# EAGLE design OSO-BOOK-B1-00 (EAGLE 9.6.2)

## Sheet 1 of 2
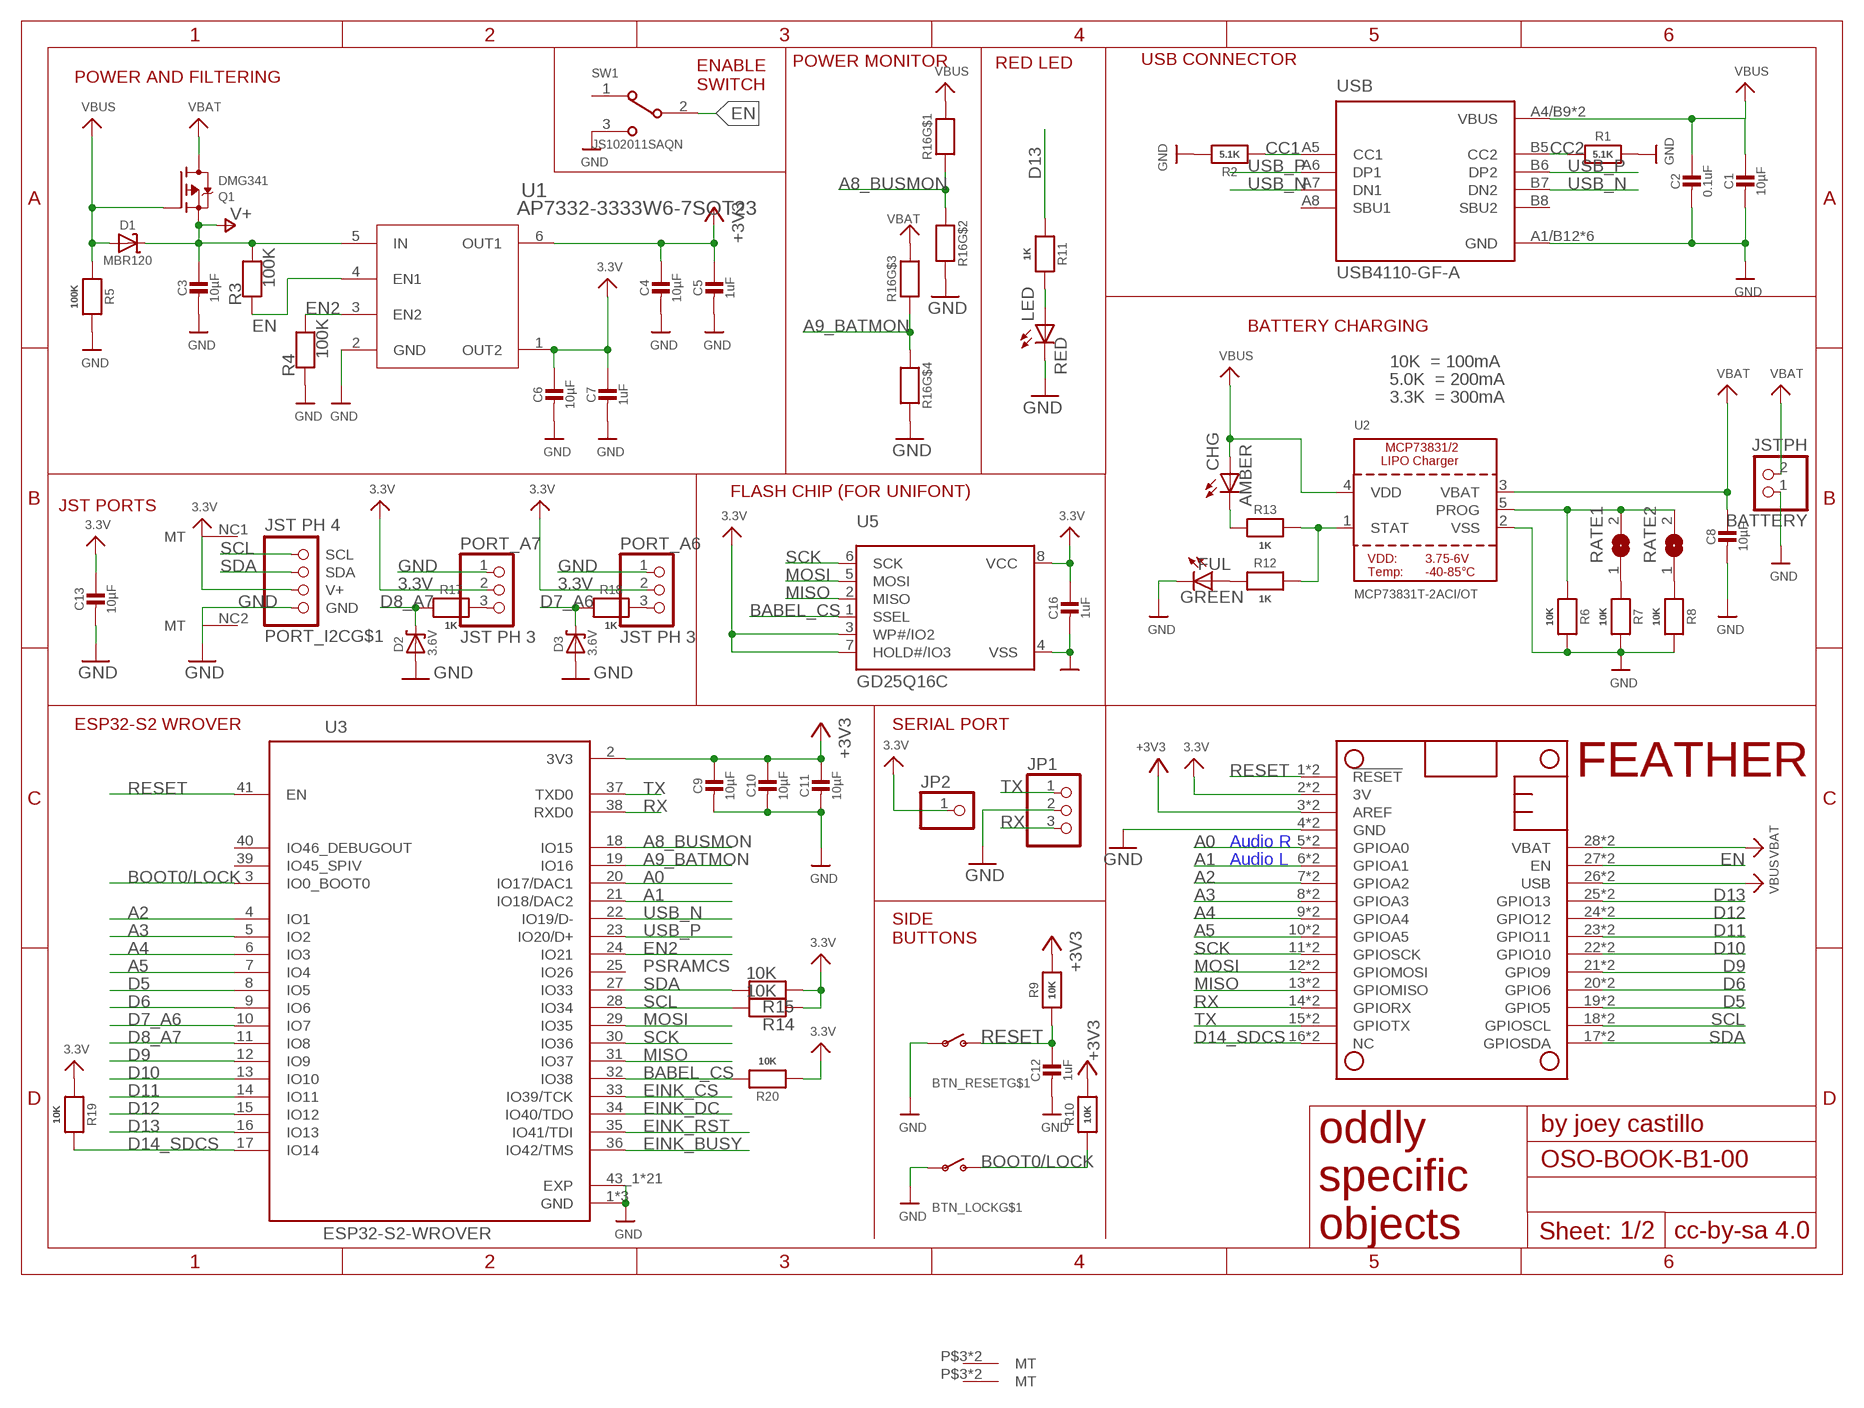
[diagram p0: schematic, sheet 1]

### Parts
BATTERY  JSTPH  CON_JST_PH_2PIN  [JSTPH2]
BTN_LOCK  SWITCH_SPSTTL3330A  [TL3330A]
BTN_RESET  SWITCH_SPSTTL3330A  [TL3330A]
C1  10µF  CAP_CERAMIC0805-NOOUTLINE  [0805-NO]
C2  0.1uF  CAP_CERAMIC0805-NOOUTLINE  [0805-NO]
C3  10µF  CAP_CERAMIC0805-NOOUTLINE  [0805-NO]
C4  10µF  CAP_CERAMIC0805-NOOUTLINE  [0805-NO]
C5  1uF  CAP_CERAMIC0805-NOOUTLINE  [0805-NO]
C6  10µF  CAP_CERAMIC0805-NOOUTLINE  [0805-NO]
C7  1uF  CAP_CERAMIC0805-NOOUTLINE  [0805-NO]
C8  10µF  CAP_CERAMIC0805-NOOUTLINE  [0805-NO]
C9  10µF  CAP_CERAMIC0805-NOOUTLINE  [0805-NO]
C10  10µF  CAP_CERAMIC0805-NOOUTLINE  [0805-NO]
C11  10µF  CAP_CERAMIC0805-NOOUTLINE  [0805-NO]
C12  1uF  CAP_CERAMIC0805-NOOUTLINE  [0805-NO]
C13  10µF  CAP_CERAMIC0805-NOOUTLINE  [0805-NO]
C16  1uF  CAP_CERAMIC0805-NOOUTLINE  [0805-NO]
CHG  AMBER  LEDCHIP-LED0805  [CHIP-LED0805]
D1  MBR120  DIODE-SCHOTTKYSOD-123  [SOD-123]
D2  3.6V  DIODE-ZENERSOD123  [SOD-123]
D3  3.6V  DIODE-ZENERSOD123  [SOD-123]
FUL  GREEN  LEDCHIP-LED0805  [CHIP-LED0805]
JP1  PINHD-1X3  [1X03]
JP2  PINHD-1X1  [1X01]
LED  RED  LEDCHIP-LED0805  [CHIP-LED0805]
MS1  FEATHERWING_SMTDUALNOHOLES  [FEATHERWING_SMT_NOHOLES]
PORT_A6  JST PH 3  CON_JST_PH_3PIN  [JSTPH3]
PORT_A7  JST PH 3  CON_JST_PH_3PIN  [JSTPH3]
PORT_I2C  JST PH 4  STEMMA_I2C_RASMT  [JSTPH4]
Q1  DMG341  MOSFET-P  [SOT23-R]
R1  5.1K  RESISTOR0805_NOOUTLINE  [0805-NO]
R2  5.1K  RESISTOR0805_NOOUTLINE  [0805-NO]
R3  100K  RESISTOR0805_NOOUTLINE  [0805-NO]
R4  100K  RESISTOR0805_NOOUTLINE  [0805-NO]
R5  100K  RESISTOR0805_NOOUTLINE  [0805-NO]
R6  10K  RESISTOR0805_NOOUTLINE  [0805-NO]
R7  10K  RESISTOR0805_NOOUTLINE  [0805-NO]
R8  10K  RESISTOR0805_NOOUTLINE  [0805-NO]
R9  10K  RESISTOR0805_NOOUTLINE  [0805-NO]
R10  10K  RESISTOR0805_NOOUTLINE  [0805-NO]
R11  1K  RESISTOR0805_NOOUTLINE  [0805-NO]
R12  1K  RESISTOR0805_NOOUTLINE  [0805-NO]
R13  1K  RESISTOR0805_NOOUTLINE  [0805-NO]
R14  10K  RESISTOR0805_NOOUTLINE  [0805-NO]
R15  10K  RESISTOR0805_NOOUTLINE  [0805-NO]
R16  EXB-V8V103JV-GOOD  [EXBV8V]
R17  1K  RESISTOR0805_NOOUTLINE  [0805-NO]
R18  1K  RESISTOR0805_NOOUTLINE  [0805-NO]
R19  10K  RESISTOR0805_NOOUTLINE  [0805-NO]
R20  10K  RESISTOR0805_NOOUTLINE  [0805-NO]
RATE1  SOLDERJUMPER  [SOLDERJUMPER_ARROW_NOPASTE]
RATE2  SOLDERJUMPER  [SOLDERJUMPER_ARROW_NOPASTE]
SW1  JS102011SAQN  [SW_JS102011SAQN]
U1  AP7332-3333W6-7SOT23  [SOT23-6]
U2  MCP73831T-2ACI/OT  MCP73831/2  [SOT23-5]
U3  ESP32-S2-WROVER  [MODULE_ESP32-S2-WROVER]
U5  GD25Q16C  MICROBUILDER_SPIFLASH_SOIC8  [MICROBUILDER_SOIC8_150MIL]
USB  USB4110-GF-A  [GCT_USB4110-GF-A]

### Nets
3.3V [power]: C6.1 C7.1 C13.1 C16.1 JP2.1 MS1.2(3V) MS1.2B(3V) PORT_A6.2 PORT_A7.2 PORT_I2C.2(V+) R14.1 R15.1 R19.1 R20.1 U1.1(OUT2) U5.3(WP#/IO2) U5.7(HOLD#/IO3) U5.8(VCC) ; also sheet 2
+3V3 [power]: C4.1 C5.1 C9.1 C10.1 C11.1 MS1.3(AREF) MS1.3B(AREF) R9.2 R10.2 U1.6(OUT1) U3.2(3V3)
A0: MS1.5(GPIOA0) MS1.5B(GPIOA0) U3.20(IO17/DAC1)
A1: MS1.6(GPIOA1) MS1.6B(GPIOA1) U3.21(IO18/DAC2)
A2: MS1.7(GPIOA2) MS1.7B(GPIOA2) U3.4(IO1)
A3: MS1.8(GPIOA3) MS1.8B(GPIOA3) U3.5(IO2)
A4: MS1.9(GPIOA4) MS1.9B(GPIOA4) U3.6(IO3)
A5: MS1.10(GPIOA5) MS1.10B(GPIOA5) U3.7(IO4)
A6: PORT_A6.3 R18.1
A7: PORT_A7.3 R17.1
A8_BUSMON: R16.1 R16.2 U3.18(IO15)
A9_BATMON: R16.3 R16.4 U3.19(IO16)
BABEL_CS: R20.2 U3.32(IO38) U5.1(SSEL)
BOOT0/LOCK: BTN_LOCK.P$2(S) R10.1 U3.3(IO0_BOOT0)
CC1: R2.1 USB.A5(CC1)
CC2: R1.1 USB.B5(CC2)
D5: MS1.19(GPIO5) MS1.19B(GPIO5) U3.8(IO5)
D6: MS1.20(GPIO6) MS1.20B(GPIO6) U3.9(IO6)
D7_A6: D3.C R18.2 U3.10(IO7)
D8_A7: D2.C R17.2 U3.11(IO8)
D9: MS1.21(GPIO9) MS1.21B(GPIO9) U3.12(IO9)
D10: MS1.22(GPIO10) MS1.22B(GPIO10) U3.13(IO10)
D11: MS1.23(GPIO11) MS1.23B(GPIO11) U3.14(IO11)
D12: MS1.24(GPIO12) MS1.24B(GPIO12) U3.15(IO12)
D13: MS1.25(GPIO13) MS1.25B(GPIO13) R11.1 U3.16(IO13)
D14_SDCS: MS1.16(NC) MS1.16B(NC) R19.2 U3.17(IO14) ; also sheet 2
EINK_BUSY: U3.36(IO42/TMS) ; also sheet 2
EINK_CS: U3.33(IO39/TCK) ; also sheet 2
EINK_DC: U3.34(IO40/TDO) ; also sheet 2
EINK_RST: U3.35(IO41/TDI) ; also sheet 2
EN: MS1.27(EN) MS1.27B(EN) R3.1 SW1.2 U1.4(EN1)
EN2: R4.2 U1.3(EN2) U3.24(IO21)
GND [gnd]: BATTERY.1 BTN_LOCK.P$1(P) BTN_RESET.P$1(P) C1.2 C2.2 C3.2 C4.2 C5.2 C6.2 C7.2 C8.2 C9.2 C10.2 C11.2 C12.2 C13.2 C16.2 D2.A D3.A FUL.C JP1.2 LED.C MS1.4(GND) MS1.4B(GND) PORT_A6.1 PORT_A7.1 PORT_I2C.1(GND) R1.2 R2.2 R4.1 R5.2 R6.2 R7.2 R8.2 R16.5 R16.7 SW1.3 U1.2(GND) U2.2(VSS) U3.1(GND) U3.26(GND) U3.42(GND) U3.43_1(EXP) U3.43_2(EXP) U3.43_3(EXP) U3.43_4(EXP) U3.43_5(EXP) U3.43_6(EXP) U3.43_7(EXP) U3.43_8(EXP) U3.43_9(EXP) U3.43_10(EXP) U3.43_11(EXP) U3.43_12(EXP) U3.43_13(EXP) U3.43_14(EXP) U3.43_15(EXP) U3.43_16(EXP) U3.43_17(EXP) U3.43_18(EXP) U3.43_19(EXP) U3.43_20(EXP) U3.43_21(EXP) U5.4(VSS) USB.A1/B12(GND) USB.B1/A12(GND) USB.S1(GND) USB.S2(GND) USB.S3(GND) USB.S4(GND) ; also sheet 2
MISO: MS1.13(GPIOMISO) MS1.13B(GPIOMISO) U3.31(IO37) U5.2(MISO) ; also sheet 2
MOSI: MS1.12(GPIOMOSI) MS1.12B(GPIOMOSI) U3.29(IO35) U5.5(MOSI) ; also sheet 2
N$1: R7.1 RATE1.1
N$4: CHG.C R13.1
N$5: R8.1 RATE2.1
N$7: LED.A R11.2
N$9: FUL.A R12.1
PROG: R6.1 RATE1.2 RATE2.2 U2.5(PROG)
RESET: BTN_RESET.P$2(S) C12.1 MS1.1(!RESET) MS1.1B(!RESET) R9.1 U3.41(EN)
RX: JP1.3 MS1.14(GPIORX) MS1.14B(GPIORX) U3.38(RXD0)
SCK: MS1.11(GPIOSCK) MS1.11B(GPIOSCK) U3.30(IO36) U5.6(SCK) ; also sheet 2
SCL: MS1.18(GPIOSCL) MS1.18B(GPIOSCL) PORT_I2C.4(SCL) R14.2 U3.28(IO34) ; also sheet 2
SDA: MS1.17(GPIOSDA) MS1.17B(GPIOSDA) PORT_I2C.3(SDA) R15.2 U3.27(IO33) ; also sheet 2
STAT: R12.2 R13.2 U2.1(STAT)
TX: JP1.1 MS1.15(GPIOTX) MS1.15B(GPIOTX) U3.37(TXD0)
USB_N: U3.22(IO19/D-) USB.A7(DN1) USB.B7(DN2)
USB_P: U3.23(IO20/D+) USB.A6(DP1) USB.B6(DP2)
V+ [power]: C3.1 D1.C Q1.2(S) R3.2 U1.5(IN)
VBAT [power]: BATTERY.2 C8.1 MS1.28(VBAT) MS1.28B(VBAT) Q1.3(D) R16.6 U2.3(VBAT)
VBUS [power]: C1.1 C2.1 CHG.A D1.A MS1.26(USB) MS1.26B(USB) Q1.1(G) R5.1 R16.8 U2.4(VDD) USB.A4/B9(VBUS) USB.B4/A9(VBUS)
Unconnected: BTN_LOCK.P$3(MT) BTN_LOCK.P$4(MT) BTN_RESET.P$3(MT) BTN_RESET.P$4(MT) PORT_I2C.NC1(MT) PORT_I2C.NC2(MT) SW1.1 U3.25(IO26) U3.39(IO45_SPIV) U3.40(IO46_DEBUGOUT) USB.A8(SBU1) USB.B8(SBU2)

### Notes on the sheet
- POWER MONITOR | RED LED | USB CONNECTOR
- POWER AND FILTERING
- ENABLE
  SWITCH
- BATTERY CHARGING
- 10K  = 100mA
- 5.0K  = 200mA
- 3.3K  = 300mA
- FLASH CHIP (FOR UNIFONT)
- JST PORTS
- ESP32-S2 WROVER | SERIAL PORT
- FEATHER
- Audio R
- Audio L
- SIDE
  BUTTONS
- PSRAMCS

## Sheet 2 of 2
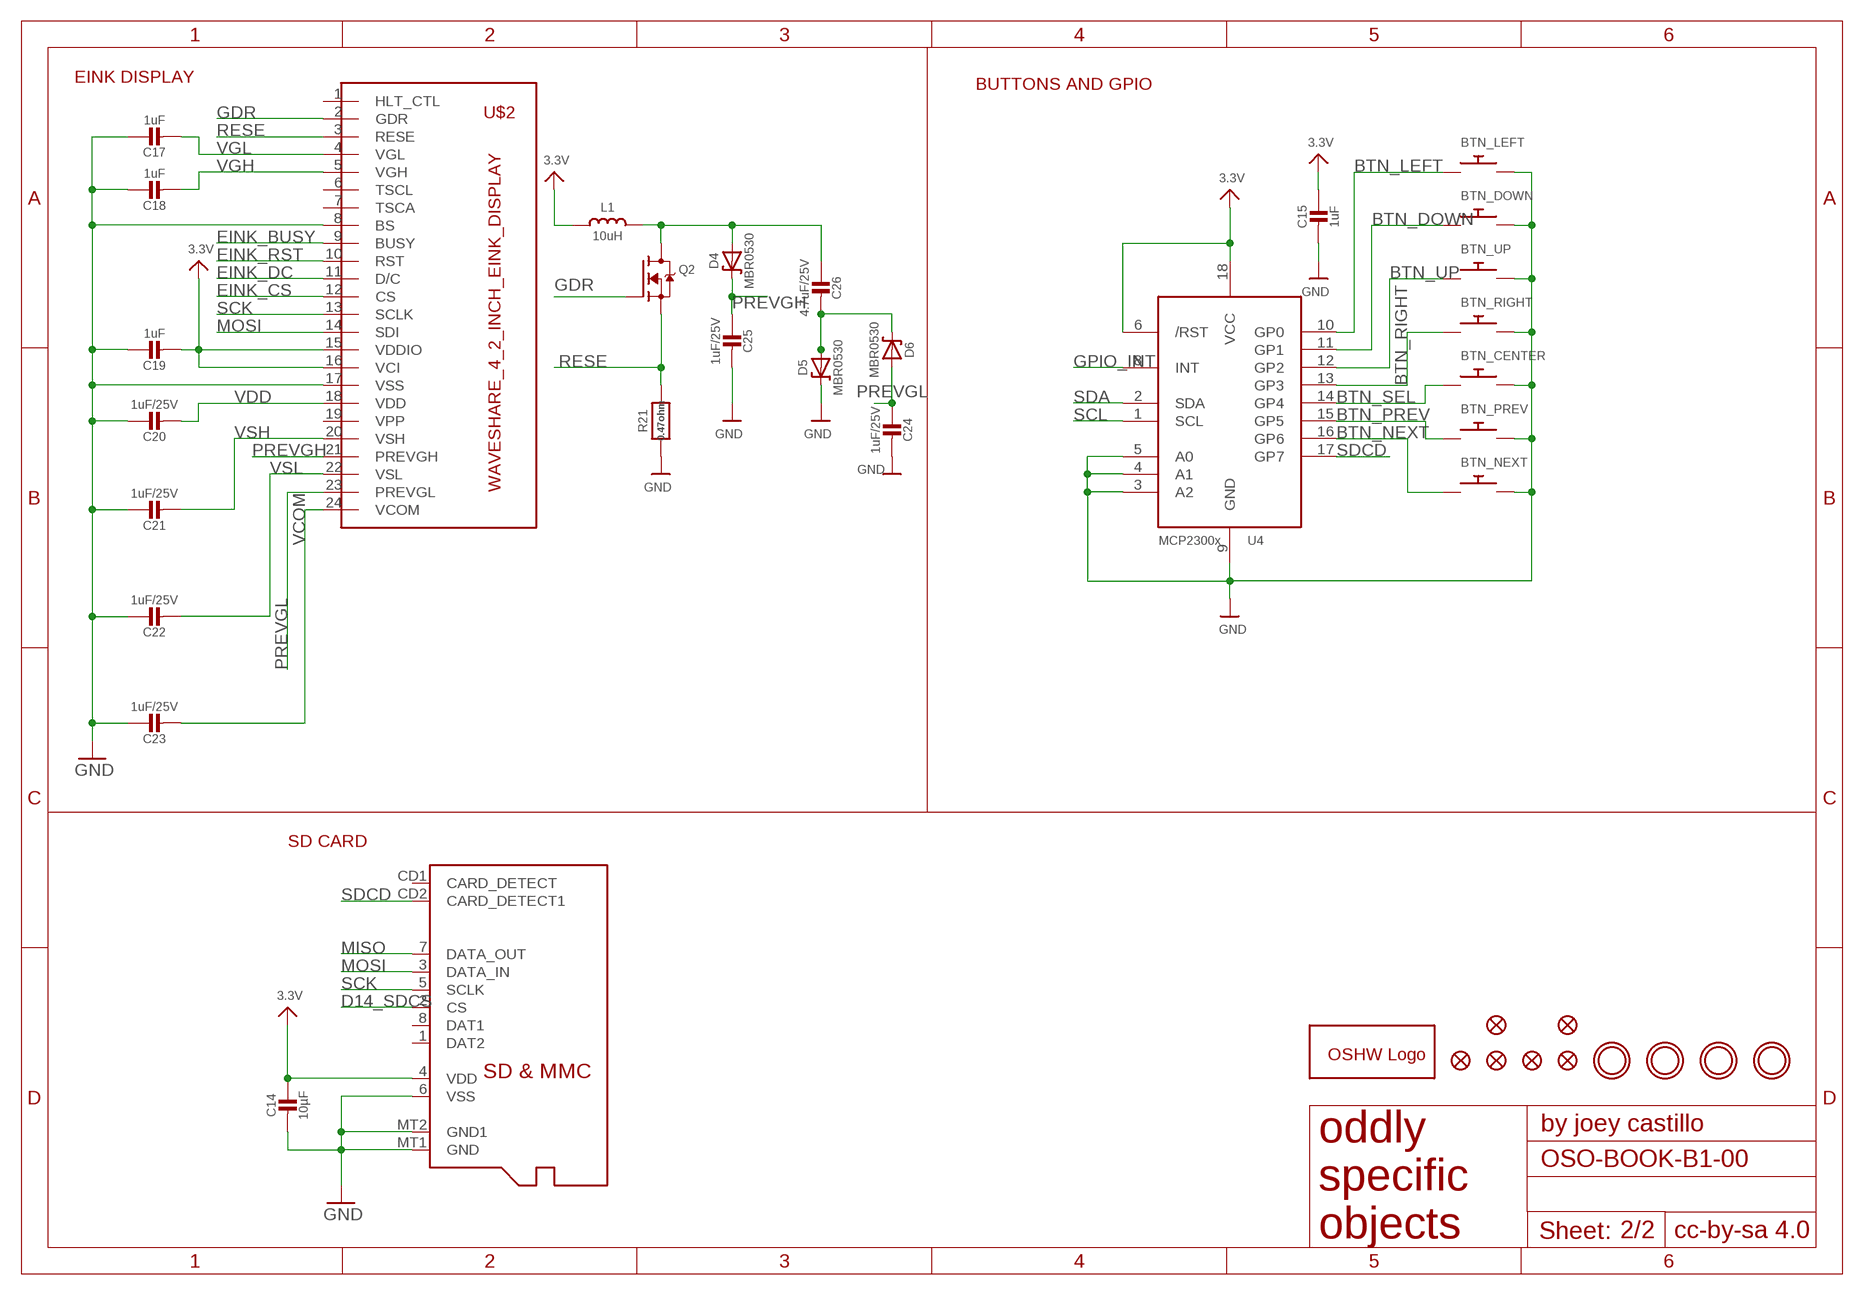
[diagram p1: schematic, sheet 2]

### Parts
BTN_CENTER  SWITCH_PUSHBUTTON_3.5X6MM  [TACTILE_3X6MM]
BTN_DOWN  SWITCH_PUSHBUTTON_3.5X6MM  [TACTILE_3X6MM]
BTN_LEFT  SWITCH_PUSHBUTTON_3.5X6MM  [TACTILE_3X6MM]
BTN_NEXT  SWITCH_PUSHBUTTON_3.5X6MM  [TACTILE_3X6MM]
BTN_PREV  SWITCH_PUSHBUTTON_3.5X6MM  [TACTILE_3X6MM]
BTN_RIGHT  SWITCH_PUSHBUTTON_3.5X6MM  [TACTILE_3X6MM]
BTN_UP  SWITCH_PUSHBUTTON_3.5X6MM  [TACTILE_3X6MM]
C14  10µF  CAP_CERAMIC0805-NOOUTLINE  [0805-NO]
C15  1uF  CAP_CERAMIC0805-NOOUTLINE  [0805-NO]
C17  1uF  CAP_CERAMIC0805-NOOUTLINE  [0805-NO]
C18  1uF  CAP_CERAMIC0805-NOOUTLINE  [0805-NO]
C19  1uF  CAP_CERAMIC0805-NOOUTLINE  [0805-NO]
C20  1uF/25V  CAP_CERAMIC0805-NOOUTLINE  [0805-NO]
C21  1uF/25V  CAP_CERAMIC0805-NOOUTLINE  [0805-NO]
C22  1uF/25V  CAP_CERAMIC0805-NOOUTLINE  [0805-NO]
C23  1uF/25V  CAP_CERAMIC0805-NOOUTLINE  [0805-NO]
C24  1uF/25V  CAP_CERAMIC0805-NOOUTLINE  [0805-NO]
C25  1uF/25V  CAP_CERAMIC0805-NOOUTLINE  [0805-NO]
C26  4.7uF/25V  CAP_CERAMIC0805-NOOUTLINE  [0805-NO]
D4  MBR0530  DIODE-SCHOTTKYSOD-123  [SOD-123]
D5  MBR0530  DIODE-SCHOTTKYSOD-123  [SOD-123]
D6  MBR0530  DIODE-SCHOTTKYSOD-123  [SOD-123]
FID1  FIDUCIAL_1MM  [FIDUCIAL_1MM]
FID2  FIDUCIAL_1MM  [FIDUCIAL_1MM]
FID3  FIDUCIAL_1MM  [FIDUCIAL_1MM]
FID4  FIDUCIAL_1MM  [FIDUCIAL_1MM]
FID5  FIDUCIAL_1MM  [FIDUCIAL_1MM]
FID6  FIDUCIAL_1MM  [FIDUCIAL_1MM]
GOLD_ORB_SM1  OSHWLOGOLOGO5MM  [OSHW_5MM]
L1  10uH  MICROBUILDER_INDUCTORNR401_BIGPADS  [MICROBUILDER_INDUCTOR_4X4MM_NR401_BIGPADS]
MICROSD  MICROSD  [MICROSD]
Q2  IRLML0100  IRLML2060TRPBF  [SOT23-3]
R21  0.47ohm  RESISTOR0805_NOOUTLINE  [0805-NO]
U4  MCP23008/SO  [SO18W]
U$1  MOUNTINGHOLE2.5  [MOUNTINGHOLE_2.5_PLATED]
U$2  WAVESHARE_4_2_INCH_EINK_DISPLAY  [EINK_DISPLAY_4_2IN]
U$4  MOUNTINGHOLE2.5  [MOUNTINGHOLE_2.5_PLATED]
U$5  MOUNTINGHOLE2.5  [MOUNTINGHOLE_2.5_PLATED]
U$7  MOUNTINGHOLE2.5  [MOUNTINGHOLE_2.5_PLATED]

### Nets
3.3V [power]: C14.1 C15.1 C19.2 L1.P$1 MICROSD.4(VDD) U4.6(/RST) U4.18(VCC) U$2.15(VDDIO) U$2.16(VCI) ; also sheet 1
BTN_DOWN: BTN_DOWN.P$1 U4.11(GP1)
BTN_LEFT: BTN_LEFT.P$1 U4.10(GP0)
BTN_NEXT: BTN_NEXT.P$1 U4.16(GP6)
BTN_PREV: BTN_PREV.P$1 U4.15(GP5)
BTN_RIGHT: BTN_RIGHT.P$1 U4.13(GP3)
BTN_SEL: BTN_CENTER.P$1 U4.14(GP4)
BTN_UP: BTN_UP.P$1 U4.12(GP2)
D14_SDCS: MICROSD.2(CS) ; also sheet 1
EINK_BUSY: U$2.9(BUSY) ; also sheet 1
EINK_CS: U$2.12(CS) ; also sheet 1
EINK_DC: U$2.11(D/C) ; also sheet 1
EINK_RST: U$2.10(RST) ; also sheet 1
GDR: Q2.1(G) U$2.2(GDR)
GND [gnd]: BTN_CENTER.P$2 BTN_DOWN.P$2 BTN_LEFT.P$2 BTN_NEXT.P$2 BTN_PREV.P$2 BTN_RIGHT.P$2 BTN_UP.P$2 C14.2 C15.2 C17.1 C18.1 C19.1 C20.1 C21.1 C22.1 C23.1 C24.2 C25.2 D5.C MICROSD.6(VSS) MICROSD.MT1(GND) MICROSD.MT2(GND1) R21.2 U4.3(A2) U4.4(A1) U4.5(A0) U4.9(GND) U$2.8(BS) U$2.17(VSS) ; also sheet 1
GPIO_INT: U4.8(INT)
MISO: MICROSD.7(DATA_OUT) ; also sheet 1
MOSI: MICROSD.3(DATA_IN) U$2.14(SDI) ; also sheet 1
N$2: C26.2 D5.A D6.C
N$3: C26.1 D4.A L1.P$2 Q2.3(D)
PREVGH: C25.1 D4.C U$2.21(PREVGH)
PREVGL: C24.1 D6.A U$2.23(PREVGL)
RESE: Q2.2(S) R21.1 U$2.3(RESE)
SCK: MICROSD.5(SCLK) U$2.13(SCLK) ; also sheet 1
SCL: U4.1(SCL) ; also sheet 1
SDA: U4.2(SDA) ; also sheet 1
SDCD: MICROSD.CD2(CARD_DETECT1) U4.17(GP7)
VCOM: C23.2 U$2.24(VCOM)
VDD: C20.2 U$2.18(VDD)
VGH: C18.2 U$2.5(VGH)
VGL: C17.2 U$2.4(VGL)
VSH: C21.2 U$2.20(VSH)
VSL: C22.2 U$2.22(VSL)
Unconnected: MICROSD.1(DAT2) MICROSD.8(DAT1) MICROSD.CD1(CARD_DETECT) U$2.1(HLT_CTL) U$2.6(TSCL) U$2.7(TSCA) U$2.19(VPP)

### Notes on the sheet
- EINK DISPLAY
- BUTTONS AND GPIO
- SD CARD

## Library data of the parts
BATTERY = microbuilder:CON_JST_PH_2PIN: JST 2-Pin Right-Angle Connector PH-Series - 4UConnector: 17311 SH-Series - 4UConnector: 07278
BTN_CENTER BTN_DOWN BTN_LEFT BTN_NEXT BTN_PREV BTN_RIGHT BTN_UP = microbuilder:SWITCH_PUSHBUTTON: Buttons SOFTTOUCHSMD_SJ - Soft touch temporary push button (Super Junk Akihabara) Compatible with SKPMANE010 [Mouser: 688-SKPMAN] C&K_KSS = Digikey: KSS221GLFS
BTN_LOCK BTN_RESET = oddlyspecific:SWITCH_SPST: Switch - SPST 4UCon 19192 (6.7x2.6mm SMT)
C1-C26 = microbuilder:CAP_CERAMIC: Ceramic Capacitors For new designs, use the packages preceded by an '_' character since they are more reliable: The following footprints should be used on most boards: _0402 - Standard footprint for regular board layouts _0603 - Standard footprint for regular board layouts _0805 - Standard footprint for regular board layouts _1206 - Standard footprint for regular board layouts For extremely tight-pitch boards where space is at a premium, the following 'micro-pitch' footprints can be used (smaller pads, no silkscreen outline, etc.): _0402MP - Micro-pitch footprint for very dense/compact boards _0603MP - Micro-pitch footprint for very dense/compact boards _0805MP - Micro-pitch footprint for very dense/compact boards _1206MP - Micro-pitch footprint for very dense/compact boards
CHG FUL LED = adafruit:LED: LED OSRAM: - CHIPLED LG R971, LG N971, LY N971, LG Q971, LY Q971, LO R971, LY R971 LH N974, LH R974 LS Q976, LO Q976, LY Q976 LO Q996 - Hyper CHIPLED LW Q18S LB Q993, LB Q99A, LB R99A - SideLED LS A670, LO A670, LY A670, LG A670, LP A670 LB A673, LV A673, LT A673, LW A673 LH A674 LY A675 LS A676, LA A676, LO A676, LY A676, LW A676 LS A679, LY A679, LG A679 - Hyper Micro SIDELED® LS Y876, LA Y876, LO Y876, LY Y876 LT Y87S - SmartLED LW L88C, LW L88S LB L89C, LB L89S, LG L890 LS L89K, LO L89K, LY L89K LS L896, LA L896, LO L896, LY L896 - TOPLED LS T670, LO T670, LY T670, LG T670, LP T670 LSG T670, LSP T670, LSY T670, LOP T670, LYG T670 LG T671, LOG T671, LSG T671 LB T673, LV T673, LT T673, LW T673 LH T674 LS T676, LA T676, LO T676, LY T676, LB T676, LH T676, LSB T676, LW T676 LB T67C, LV T67C, LT T67C, LS T67K, LO T67K, LY T67K, LW E67C LS E67B, LA E67B, LO E67B, LY E67B, LB E67C, LV E67C, LT E67C LW T67C LS T679, LY T679, LG T679 LS T770, LO T770, LY T770, LG T770, LP T770 LB T773, LV T773, LT T773, LW T773 LH T774 LS E675, LA E675, LY E675, LS T675 LS T776, LA T776, LO T776, LY T776, LB T776 LHGB T686 LT T68C, LB T68C - Hyper Mini TOPLED® LB M676 - Mini TOPLED Santana® LG M470 LS M47K, LO M47K, LY M47K Source: http://www.osram.convergy.de/
D1 D4-D6 = microbuilder:DIODE-SCHOTTKY
D2 D3 = microbuilder:DIODE-ZENER: Zener Diode SMA: 30V 1W Zener Diode, 1.2Vf - Digikey: SMAZ30-FDICT-ND
FID1-FID6 = microbuilder:FIDUCIAL: Fiducial Alignment Points Various fiducial points for machine vision alignment.; BOM: EXCLUDE
GOLD_ORB_SM1 = oshw:OSHWLOGO: The OSHW logo for PCB layout
JP1 = adafruit:PINHD-1X3: PIN HEADER
JP2 = adafruit:PINHD-1X1: Pin header 1x1 for 0.1" spacing With round pins
L1 = Adafruit 3.5in 480x320 FeatherWing:MICROBUILDER_INDUCTOR: Inductors 0603: 10nH Ceramic Inductor - microwire antenna/RF (Digikey: 712-1434-2-ND) 0805: 560nH Ceramic Inductor - RF (Digikey: 553-1047-1-ND) 270nH Ceramic Inductor - Q = 40@250MHz, +-5%, 1 Ohm DC Resistance (Digikey: 535-10506-2-ND) 1007 (2518 Metric) SMT: 10µH 10% 250mOhm 820mA 1007 Inductor (Digikey: 587-2189-1-ND) 22µH 10% 500mOhm 580mA 1007 Inductor (Digikey: 587-2190-1-ND) 47µH 10% 950mOhm 420mA 1007 Inductor (Digikey: 587-2191-1-ND) 47µH 5% 100mOhm 1A 1008 Inductor (Digikey: 732-1816-1-ND) 5.0x5.0mm (Taiyo Yuden NR5040 Series) 6.8µH 20% 2.3A 64mOhm Inductor (Digikey: 587-2374-2-ND) 5.0x5.0mm (TDK VLC5045 Series) 4.7µH 20% 3.3A 34mOhm Inductor (Digikey: 445-6526-1-ND) 6.8µH 20% 2.7A 46mOhm Inductor (Digikey: 445-6527-1-ND) 6.0x6.0mm (TDK VLC6045 Series) 4.7µH 20% 3.8A 27mOhm Inductor (Digikey: 445-6538-2-ND) 6.8µH 20% 3A 41mOhm Inductor (Digikey: 445-6540-1-ND) 6.2µH 30% 2.2A 45mOhm Inductor (Digikey: SRR5028-6R2YCT-ND) - Not TDK VLC6045 but footprint should match 6.0x6.0mm (TDK SLF6045 Series) 6.8uH 30% 2A 33mOhm Inductor (Digikey: 445-4572-1-ND, Mouser: 810-SLF645T6R8N2R0PF) 6.0x6.0mm (Sumida CDRH5D28 Series) 6.2uH 30% 1.8A 45mOhm Inductor (Digikey: 308-1542-1-ND) Taiyo Yuden NR3015T2R2M - 2.2uH 20% 1.5A (Digikey: 587-1648-2-ND, Mouser: 963-NR3015T2R2M) - Used with TI TPS62172 CoilCraft RFID Transponder Coil - MA5532-AE (For use with AS3935 Lightning Sensor) Taiyo Yuden NRH2412T2R2MNGH - 2.2uH 20% 1AA (Digikey: 587-3443-1-ND) - Used with TI LM3671 Vishay IHLP 1.0uH Molded Inductor - 24mOhm DCR, 5A, +/-20%, -55°C-125°C (Digikey: 541-1319-1-ND)
MICROSD = adafruit:MICROSD: Micro-SD / Transflash card holder with SPI pinout For the 3M # 2908-05WB-MG and/or 4UCON #19656 push-push type
MS1 = pygamer-microbuilder:FEATHERWING
PORT_A6 PORT_A7 = microbuilder:CON_JST_PH_3PIN
PORT_I2C = microbuilder:STEMMA_I2C
Q1 = microbuilder:MOSFET-P: P-Channel Mosfet LEGEND VDS: Voltage Drain-Source ID: Drain Current RDS(ON): Drain-Source On-State Resistance VGS(TH): Gate-Source Threshold Voltage CISS: Drain-Source Input Capacitance SOT-23 Name VDS ID RDS(ON) VGS(TH) CISS Order Number IRLML5103 30V 760mA 600 mOhm -- 75pF @ 25V Digikey: IRLML5103PBFCT-ND IRLML6401 12V 4.3A 50 mOhm 950mV @ 250µA 830pF @ 10V Digikey: IRLML6401PBFTR-ND NTR0202PL 20V 400mA 800 mOhm 2.3V @ 250uA 70pF @ 5V Digikey: NTR0202PLT1GOSTR-ND NTR4101PT1G 20V 1.8A 85 mOhm 1.2V @ 250uA 675pF @ 10V Digikey: NTR4101PT1GOSCT-ND DMP2004K 20V 600mA 900 mOhm 1V @ 250uA 175pF @ 16V Digikey: DMP2004KDICT-ND PMV65XP 20V 3.9A 76 mOhm 950mV @ 1mA 725pF @ 20V Digikey: 568-2358-2-ND TO-252 Name VDS ID RDS(ON) VGS(TH) CISS Order Number AOD417 30V 25A 34 mOhm 3V @ 250µA 920pF @ 15V Digikey: 785-1106-2-ND PowerPak Name VDS ID RDS(ON) VGS(TH) CISS Order Number AON7401 30V 12A 14 mOhm 3V @ 250µA 2600pF @ 15V Digikey: 785-1302-1-ND
Q2 = Parts:IRLML2060TRPBF
R1-R15 R17-R21 = microbuilder:RESISTOR: Resistors For new designs, use the packages preceded by an '_' character since they are more reliable: The following footprints should be used on most boards: _0402 - Standard footprint for regular board layouts _0603 - Standard footprint for regular board layouts _0805 - Standard footprint for regular board layouts _1206 - Standard footprint for regular board layouts For extremely tight-pitch boards where space is at a premium, the following 'micro-pitch' footprints can be used (smaller pads, no silkscreen outline, etc.): _0402MP - Micro-pitch footprint for very dense/compact boards _0603MP - Micro-pitch footprint for very dense/compact boards _0805MP - Micro-pitch footprint for very dense/compact boards _1206MP - Micro-pitch footprint for very dense/compact boards
R16 = resistor array:EXB-V8V103JV-GOOD; MANUFACTURER_PART_NUMBER: EXBV8V103JV; VENDOR: Panasonic
RATE1 RATE2 = microbuilder:SOLDERJUMPER: SMD Solder JUMPER Solder the two pads together to create a connection, or remove the solder to break it. REFLOW - Use this footprint for solder paste and reflow ovens. WAVE - Use this footprint for hand-soldering (larger pads). CLOSED - Has a trace between the two pads to ensure it is closed by default. The trace needs to be cut to disable the jumper, and can be closed again by creating a solder bridge between the two pads.; BOM: EXCLUDE
SW1 = JS102011SAQN:JS102011SAQN: JS10 Series SPDT On-On 6 V 0.3 A Gull Wing SMT Slide Switch http://www.snapeda.com/parts/JS102011SAQN/C%26K%20Components/view-part/; DESCRIPTION: Slide Switch SPDT Surface Mount, Right Angle; DIGI-KEY_PART_NUMBER: 401-1999-1-ND; DIGI-KEY_PURCHASE_URL: https://www.digikey.com/product-detail/en/c-k/JS102011SAQN/401-1999-1-ND/1640114?utm_source=snapeda&utm_medium=aggregator&utm_campaign=symbol; MF: C&K; MP: JS102011SAQN; PACKAGE: None
U1 = My Stuff:AP7332-3333W6-7
U2 = microbuilder:MCP73831/2: MCP73831/2 LIPO Charger VDD: 3.75 - 6V Temp -40 - 85°C Programmable Charge Rate: 15-500mA NOTE: STAT is a tri-state logic output on the MCP73831 and an open-drain output on the MCP73832. SOT23-5 with 4.2V output and tri-state logic on STAT = MCP73831T-2ACI/OT
U3 = adafruit_wireless:ESP32-S2-WROVER: WiFi 802.11b/g/n Transceiver Module 2.4GHz Antenna Not Included Surface Mount Check prices <https://snapeda.com/parts/ESP32-S2-WROVER/Espressif%20Systems/view-part/?ref=eda>; AVAILABILITY: Warning; DESCRIPTION: WiFi 802.11b/g/n Transceiver Module 2.4GHz Antenna Not Included Surface Mount; DIGIKEY-PURCHASE-URL: https://snapeda.com/shop?store=DigiKey&id=4614060; MF: Espressif Systems; MP: ESP32-S2-WROVER; PACKAGE: VFQFN-56 Espressif Systems; PRICE: None
U4 = My Stuff:MCP23008: MCP23008 Inexpensive i2c i/o expander - 8 general purpose i/o pins with optional pullups
U5 = Adafruit Feather M0 Express:MICROBUILDER_SPIFLASH_SOIC8: SOIC8 SPI Flash Be careful with the size since SOIC8 flash comes in several 'widths' SOIC8 150 mil M25P16 - 16Mbit (2Mbit x 8) Serial Flash (75MHz SPI Bus), Supply: 2.7-3.6V Digikey: SOIC8 - M25P16-VMN6P-ND SOIC8 208 mil W25Q16BVSSIG - 16Mbit (2Mbit x 8) Serial Flash (104MHz SPI Bus), Supply: 2.7-3.6V Digikey: SOIC8 - W25Q16BVSSIG-ND
U$1 U$4 U$5 U$7 = microbuilder:MOUNTINGHOLE: Mounting Hole For #2 screws (0.086"/2.18mm width, 0.094"/2.4mm hole) use 2.5mm; BOM: EXCLUDE
U$2 = My Stuff:WAVESHARE_4_2_INCH_EINK_DISPLAY
USB = USB4110-GF-A:USB4110-GF-A: CONN USB 2.0 TYPE-C R/A SMT; DESCRIPTION: USB-C (USB TYPE-C) USB 2.0 Receptacle Connector 24 (16+8 Dummy) Position Surface Mount, Right Angle; Through Hole; MF: GCT; MP: USB4110-GF-A; PACKAGE: None; PURCHASE-URL: https://pricing.snapeda.com/search/part/USB4110-GF-A/?ref=eda

## Net classes
0 default: width 0.152 mm, drill 0.254 mm
1 power: width 0.254 mm, drill 0.254 mm
2 gnd: width 0.305 mm, drill 0.305 mm

## Board
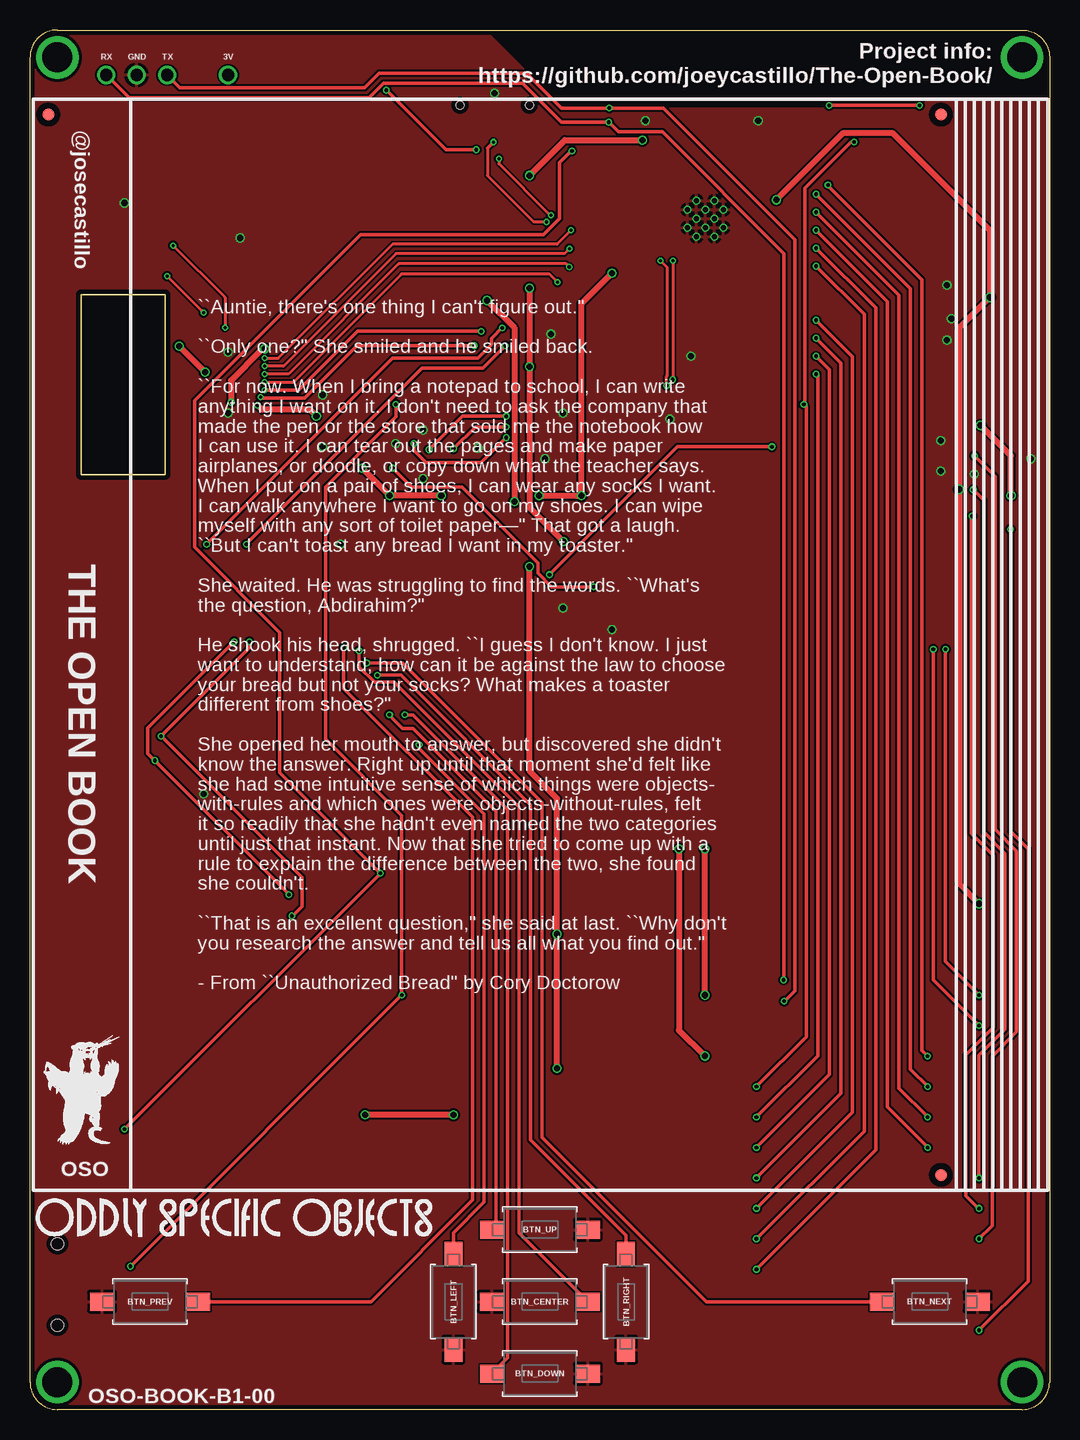
[diagram p2: board, top side]
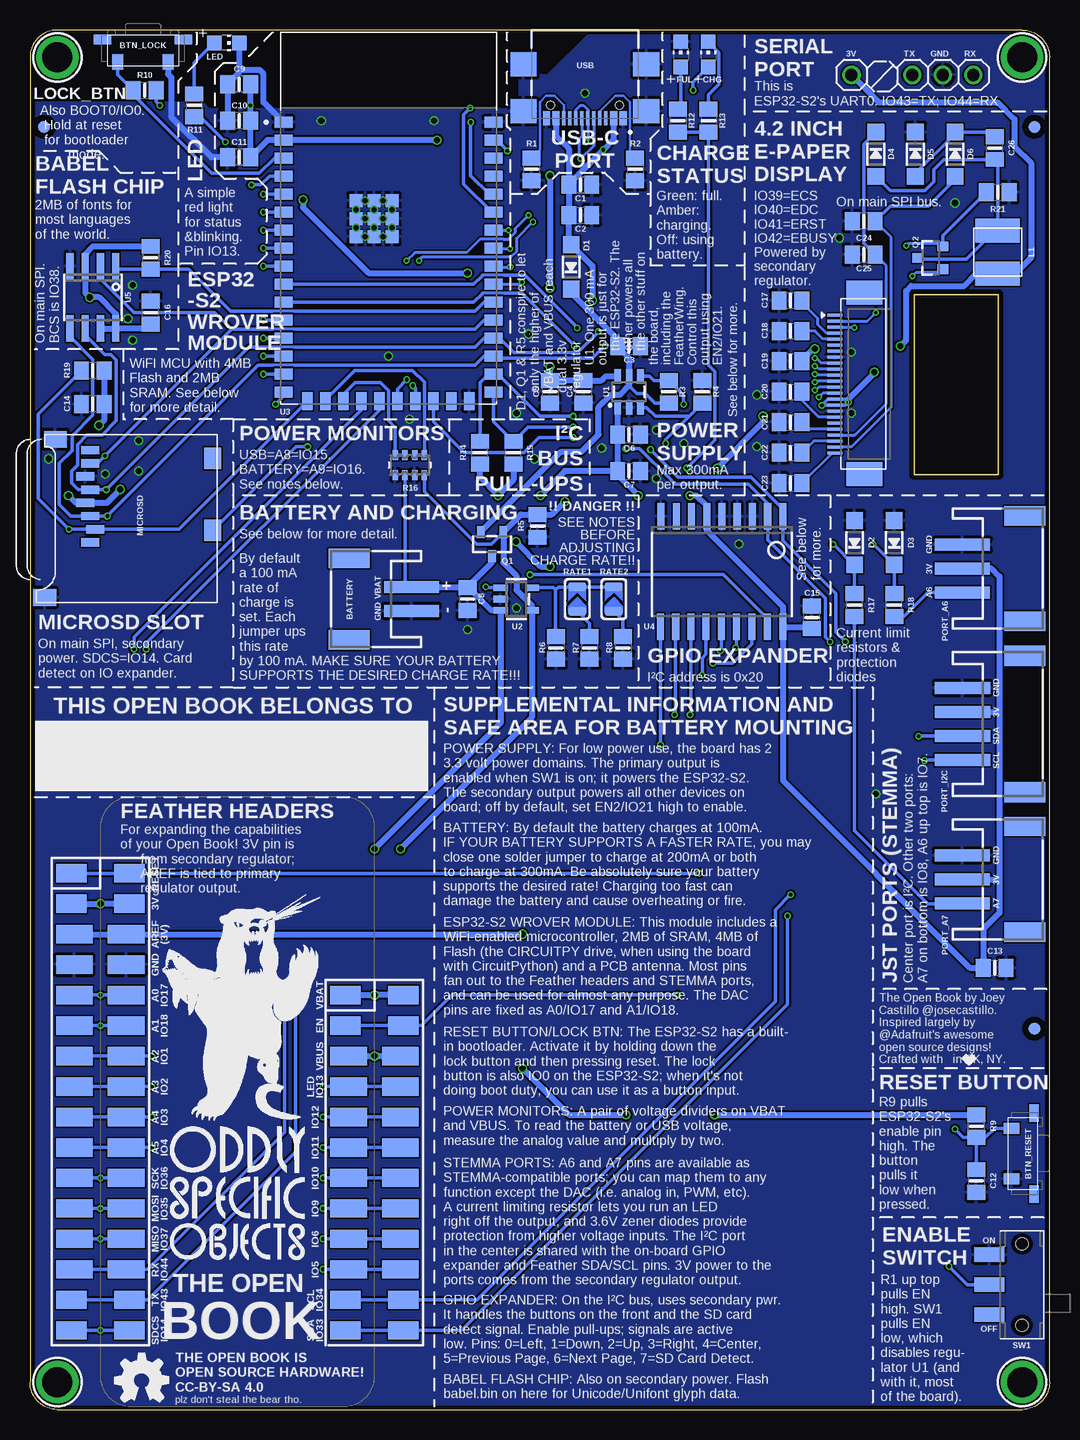
[diagram p3: board, bottom side, seen from below]

Size 85 x 115 mm. Coordinates in mm from the lower left corner, seen from the top.
Outline: 2.29,115 82.71,115 arc-90 85,112.71 85,2.29 arc-90 82.71,0 2.29,0 arc-90 0,2.29 0,112.71 arc-90 2.29,115
Copper layers (1*16): Top 0.035559375mm / dielectric 1.6mm / Bottom 0.035559375mm
Design rules "oshpark-2layer *": minimum track width 6mil, minimum drill 10mil, track to track 6mil, track to pad 6mil, pad to pad 6mil, via to via 6mil, smd to smd 6mil, copper to edge 15mil, drill to drill 6mil, minimum pad ring 5mil, minimum via ring 5mil, stop-mask expansion 2.5mil, vias tented up to drill 20mil, thermal gap 10mil
bKeepout: area -56,-78 to -6,-18; area 89,-143.7 to 125,-83.7; area -1,-78 to 69,-18; area 75,-78 to 125,-18; area 42,-135 to 84,-84

### Footprints (pad centres in the part's own frame; a part is rotated, then mirrored left to right if it is on the bottom)
JSTPH2 = smd 1 x 4.6: 1 -1,-3.7; 2 1,-3.7 | smd 1.6 x 3.4: NC1 -3.4,1.5; NC2 3.4,1.5
TACTILE_3X6MM = smd 2 x 1.5: P$1 -4,0; P$2 4,0
TL3330A = smd 0.9 x 1.27: P$1 -2.1,0.89; P$2 2.1,0.89 | smd 1.45 x 0.8: P$3 -3.375,-1; P$4 3.375,-1
0805-NO = smd 1.24 x 1.5: 1 -0.95,0; 2 0.95,0
CHIP-LED0805 = smd 1.2 x 1.2: A 0,-1.05; C 0,1.05
SOD-123 = smd 1.4 x 1.4: A 1.85,0; C -1.85,0
FIDUCIAL_1MM = smd 1 x 1: 1 0,0
1X03 = drill 1.016: 1 -2.54,0; 2 0,0; 3 2.54,0
1X01 = drill 1.016: 1 0,0
MICROBUILDER_INDUCTOR_4X4MM_NR401_BIGPADS = smd 2 x 3.7: P$1 -1.8,0; P$2 1.8,0
MICROSD = smd 0.7 x 1.5: 1 9,-10.64; 2 7.9,-10.24; 3 6.8,-10.64; 4 5.7,-11.04; 5 4.6,-10.64; 6 3.5,-11.04; 7 2.4,-10.64; 8 1.3,-10.64 | smd 1.8 x 1.4: CD1 2,-0.44; CD2 8,-0.44 | smd 1.4 x 1.9: MT1 0.4,-13.54; MT2 13.6,-14.44
FEATHERWING_SMT_NOHOLES = smd 1.524 x 2.54: 1 6.35,2.413; 1B 6.35,-2.413; 2 8.89,2.413; 2B 8.89,-2.413; 15 41.91,2.413; 15B 41.91,-2.413; 16 44.45,2.413; 16B 44.45,-2.413; 17 44.45,20.447; 17B 44.45,25.273; 18 41.91,20.447; 18B 41.91,25.273; 27 19.05,20.447; 27B 19.05,25.273; 28 16.51,20.447; 28B 16.51,25.273 | smd 1.524 x 3.048: 3 11.43,2.159; 3B 11.43,-2.159; 4 13.97,2.159; 4B 13.97,-2.159; 5 16.51,2.159; 5B 16.51,-2.159; 6 19.05,2.159; 6B 19.05,-2.159; 7 21.59,2.159; 7B 21.59,-2.159; 8 24.13,2.159; 8B 24.13,-2.159; 9 26.67,2.159; 9B 26.67,-2.159; 10 29.21,2.159; 10B 29.21,-2.159; 11 31.75,2.159; 11B 31.75,-2.159; 12 34.29,2.159; 12B 34.29,-2.159; 13 36.83,2.159; 13B 36.83,-2.159; 14 39.37,2.159; 14B 39.37,-2.159; 19 39.37,20.701; 19B 39.37,25.019; 20 36.83,20.701; 20B 36.83,25.019; 21 34.29,20.701; 21B 34.29,25.019; 22 31.75,20.701; 22B 31.75,25.019; 23 29.21,20.701; 23B 29.21,25.019; 24 26.67,20.701; 24B 26.67,25.019; 25 24.13,20.701; 25B 24.13,25.019; 26 21.59,20.701; 26B 21.59,25.019
JSTPH3 = smd 1 x 4.6: 1 -2,-2.7; 2 0,-2.7; 3 2,-2.7 | smd 1.6 x 3.4: NC1 -4.4,2.5; NC2 4.4,2.5
JSTPH4 = smd 1 x 4.6: 1 -3,-3.7; 2 -1,-3.7; 3 1,-3.7; 4 3,-3.7 | smd 1.7 x 3.4: NC1 -5.7,1.5; NC2 5.7,1.5
SOT23-R = smd 0.635 x 1.016: 1 -0.95,-1; 2 0.95,-1; 3 0,1
SOT23-3 = smd 0.8 x 0.9: 1 -0.95,-1; 2 0.95,-1; 3 0,1.1
EXBV8V = smd 0.838 x 0.457: 1 -0.838,1.219; 2 -0.838,0.406; 3 -0.838,-0.406; 4 -0.838,-1.219; 5 0.838,-1.219; 6 0.838,-0.406; 7 0.838,0.406; 8 0.838,1.219
SOLDERJUMPER_ARROW_NOPASTE = smd 0.762 x 1.524: 1 -1.016,0; 2 1.016,0
SW_JS102011SAQN = smd 1.2 x 2.5: 1 -2.5,2.75; 2 0,2.75; 3 2.5,2.75 | hole 1: -3.4,0; 3.4,0
SOT23-6 = smd 0.55 x 1.2: 1 0.95,1.3; 2 0,1.3; 3 -0.95,1.3; 4 -0.95,-1.3; 5 0,-1.3; 6 0.95,-1.3
SOT23-5 = smd 0.55 x 1.2: 1 -0.95,-1.3; 2 0,-1.3; 3 0.95,-1.3; 4 0.95,1.3; 5 -0.95,1.3
MODULE_ESP32-S2-WROVER = smd 1.5 x 0.9: 1 -8.75,8; 2 -8.75,6.5; 3 -8.75,5; 4 -8.75,3.5; 5 -8.75,2; 6 -8.75,0.5; 7 -8.75,-1; 8 -8.75,-2.5; 9 -8.75,-4; 10 -8.75,-5.5; 11 -8.75,-7; 12 -8.75,-8.5; 13 -8.75,-10; 14 -8.75,-11.5; 15 -8.75,-13; 16 -8.75,-14.5; 27 8.75,-14.5; 28 8.75,-13; 29 8.75,-11.5; 30 8.75,-10; 31 8.75,-8.5; 32 8.75,-7; 33 8.75,-5.5; 34 8.75,-4; 35 8.75,-2.5; 36 8.75,-1; 37 8.75,0.5; 38 8.75,2; 39 8.75,3.5; 40 8.75,5; 41 8.75,6.5; 42 8.75,8 | smd 0.9 x 1.5: 17 -6.75,-15.25; 18 -5.25,-15.25; 19 -3.75,-15.25; 20 -2.25,-15.25; 21 -0.75,-15.25; 22 0.75,-15.25; 23 2.25,-15.25; 24 3.75,-15.25; 25 5.25,-15.25; 26 6.75,-15.25 | smd 1.1 x 1.1: 43_1 -2.69,1.45; 43_2 -1.19,1.45; 43_3 0.31,1.45; 43_4 -2.69,-0.05; 43_5 -1.19,-0.05; 43_6 0.31,-0.05; 43_7 -2.69,-1.55; 43_8 -1.19,-1.55; 43_9 0.31,-1.55 | drill 0.4: 43_10 -1.94,1.45; 43_11 -0.44,1.45; 43_12 -2.69,0.7; 43_13 -1.19,0.7; 43_14 0.31,0.7; 43_15 -1.94,-0.05; 43_16 -0.44,-0.05; 43_17 -2.69,-0.8; 43_18 -1.19,-0.8; 43_19 0.31,-0.8; 43_20 -1.94,-1.55; 43_21 -0.44,-1.55
SO18W = smd 0.6 x 2.2: 1 -4.445,-4.6; 2 -3.175,-4.6; 3 -1.905,-4.6; 4 -0.635,-4.6; 5 0.635,-4.6; 6 1.905,-4.6; 7 3.175,-4.6; 8 4.445,-4.6; 9 5.715,-4.6; 10 5.775,4.6; 11 4.505,4.6; 12 3.235,4.6; 13 1.965,4.6; 14 0.695,4.6; 15 -0.575,4.6; 16 -1.845,4.6; 17 -3.145,4.6; 18 -4.445,4.6
MICROBUILDER_SOIC8_150MIL = smd 0.6 x 2.2: 1 -1.905,-2.6; 2 -0.635,-2.6; 3 0.635,-2.6; 4 1.905,-2.6; 5 1.905,2.6; 6 0.635,2.6; 7 -0.635,2.6; 8 -1.905,2.6
MOUNTINGHOLE_2.5_PLATED = drill 2.5 pad 3.2: P$1 0,0
EINK_DISPLAY_4_2IN = smd 1.25 x 0.275 bottom: 1 17.653,-16.717; 2 17.653,-17.217; 3 17.653,-17.717; 4 17.653,-18.217; 5 17.653,-18.717; 6 17.653,-19.217; 7 17.653,-19.717; 8 17.653,-20.217; 9 17.653,-20.717; 10 17.653,-21.217; 11 17.653,-21.717; 12 17.653,-22.217; 13 17.653,-22.717; 14 17.653,-23.217; 15 17.653,-23.717; 16 17.653,-24.217; 17 17.653,-24.717; 18 17.653,-25.217; 19 17.653,-25.717; 20 17.653,-26.217; 21 17.653,-26.717; 22 17.653,-27.217; 23 17.653,-27.717; 24 17.653,-28.217 | smd 3 x 2 bottom: SPRT1 15.193,-14.867; SPRT2 15.193,-29.977
GCT_USB4110-GF-A = smd 0.6 x 1.15: A1/B12 -3.2,1.075; A4/B9 -2.4,1.075; B1/A12 3.2,1.075; B4/A9 2.4,1.075 | smd 0.3 x 1.15: A5 -1.25,1.075; A6 -0.25,1.075; A7 0.25,1.075; A8 1.25,1.075; B5 1.75,1.075; B6 0.75,1.075; B7 -0.75,1.075; B8 -1.75,1.075 | smd 2.18 x 2: S1 -5.11,0.5; S2 5.11,0.5; S3 -5.11,-3.43; S4 5.11,-3.43 | hole 0.65: -2.89,0; 2.89,0

### Placement (x,y rotation side)
BATTERY  56.9,67.56 90 bottom
BTN_CENTER  42.5,9 180 top
BTN_DOWN  42.5,3 0 top
BTN_LEFT  35.3,9 270 top
BTN_LOCK  75.58,113.22 180 bottom
BTN_NEXT  75,9 0 top
BTN_PREV  10,9 180 top
BTN_RESET  2.29,21.34 90 bottom
BTN_RIGHT  49.7,9 270 top
BTN_UP  42.5,15 0 top
C1  39.12,102.11 0 bottom
C2  39.12,99.57 0 bottom
C3  35.05,88.65 0 bottom
C4  38.86,84.84 270 bottom
C5  41.66,84.84 270 bottom
C6  35.05,81.28 0 bottom
C7  35.05,78.23 0 bottom
C8  48.51,67.56 270 bottom
C9  67.56,110.49 180 bottom
C10  67.56,107.44 180 bottom
C11  67.56,104.39 180 bottom
C12  6.1,19.05 270 bottom
C13  4.57,36.83 0 bottom
C14  79.76,83.82 180 bottom
C15  19.81,66.04 90 bottom
C16  74.93,91.44 90 bottom
C17  21.59,92.46 0 bottom
C18  21.59,89.92 0 bottom
C19  21.59,87.38 0 bottom
C20  21.59,84.84 0 bottom
C21  21.59,82.3 0 bottom
C22  21.59,79.76 0 bottom
C23  21.59,77.22 0 bottom
C24  15.49,99.06 180 bottom
C25  15.49,96.27 180 bottom
C26  4.57,105.16 90 bottom
CHG  28.45,112.97 0 bottom
D1  39.88,95.25 90 bottom
D2  16.26,72.26 90 bottom
D3  12.95,72.26 90 bottom
D4  14.48,104.65 270 bottom
D5  11.18,104.65 270 bottom
D6  7.87,104.65 270 bottom
FID1  83.82,106.93 0 bottom
FID2  75.95,19.56 0 top
FID3  1.27,106.93 0 bottom
FID4  75.95,107.95 0 top
FID5  1.27,31.75 0 bottom
FID6  1.52,107.95 0 top
FUL  30.73,112.97 0 bottom
GOLD_ORB_SM1  75.69,2.41 0 bottom
JP1  8.89,111.25 0 bottom
JP2  16.51,111.25 0 bottom
L1  4.32,96.47 90 bottom
LED  68.58,113.92 270 bottom
MICROSD  69.34,81.28 270 bottom
MS1  79.14,51.05 270 bottom
PORT_A6  4.57,70.1 270 bottom
PORT_A7  4.57,44.2 270 bottom
PORT_I2C  3.56,57.15 270 bottom
Q1  46.48,72.14 180 bottom
Q2  9.91,96.01 90 bottom
R1  43.18,103.38 270 bottom
R2  34.54,103.38 270 bottom
R3  31.75,84.84 270 bottom
R4  28.96,84.84 270 bottom
R5  42.67,73.66 270 bottom
R6  41.15,63.5 270 bottom
R7  38.35,63.5 270 bottom
R8  35.56,63.5 270 bottom
R9  6.1,23.62 90 bottom
R10  75.44,109.98 0 bottom
R11  71.3,108.71 90 bottom
R12  30.99,107.44 270 bottom
R13  28.42,107.44 270 bottom
R14  47.5,79.76 90 bottom
R15  44.7,79.76 90 bottom
R16  53.34,78.74 270 bottom
R17  16.26,67.06 90 bottom
R18  12.95,67.06 90 bottom
R19  79.76,86.61 180 bottom
R20  74.93,96.01 270 bottom
R21  4.32,101.47 0 bottom
RATE1  39.37,67.56 90 bottom
RATE2  36.32,67.56 90 bottom
SW1  2.29,10.41 90 bottom
U1  35.05,84.84 180 bottom
U2  44.45,67.56 270 bottom
U3  55.12,99.31 0 bottom
U4  26.67,69.85 180 bottom
U5  79.76,92.71 180 bottom
U$1  2.29,2.29 0 bottom
U$2  0.25,107.95 0 top
U$4  82.71,2.29 0 bottom
U$5  2.29,112.71 0 bottom
U$7  82.71,112.71 0 bottom
U$45  [OSO_WORDMARK_125X1300MIL_1000DPI]  0.51,16 0 top
U$47  [OSO_BEAR_525X750MIL_1000DPI]  67.44,33.53 0 bottom
U$49  [OSO_WORDMARK_THREELINE_450MIL_1000DPI]  67.69,18.03 0 bottom
U$65  [OSO_BEAR_250X360MIL_1000DPI]  4.32,26.67 0 top
USB  38.73,108.71 180 bottom

### Tracks (layer width: path | path; a pad name or v marks a point on that pad's centre or on a via)
3.3V  (via drill 0.3, 0.51)
  Top 0.508: v23.88,82.8 23.34,83.34 19.36,83.34 v18.97,83.72 | v42.44,76.2 v45.97,76.2 45.97,92.2 v48.51,94.74 | v62.23,100.84 67.82,106.43 71.88,106.43 80.01,98.3 v80.01,92.71 77.47,90.17 v77.47,76.71 77.47,43.81 v79.12,42.16 | v81.79,76.2 81.79,79.5 v79.25,82.04 | v27.7,78.48 v29.97,76.2 v34.29,76.2 | v19.56,88.42 19.43,88.3 19.28,88.3 16.76,85.77 v16.76,83.97 | v14.61,86.49 v12.45,88.65
  Bottom 0.305: MS1.2 76.98,41.91 | U$2.15 18.46,84.23 v18.97,83.72 18.96,83.73 U$2.16 17,83.73 v16.76,83.97 17.02,84.23 U$2.15
  Bottom 0.508: U1.1 C6.1 C7.1 | C7.1 36,77.91 v34.29,76.2 | v29.97,76.2 29.46,76.2 28.57,75.31 U4.6 28.57,73.28 22.23,66.93 U4.18 | U4.18 19.97,65.25 C15.1 | U4.18 22.23,52.42 6.63,36.83 C13.1 5.52,40.05 4.18,41.39 4.18,44.2 | PORT_A6.2 4.83,70.1 4.18,69.46 4.18,58.17 | 4.18,58.17 4.18,44.2 | PORT_A7.2 4.18,44.2 | PORT_I2C.2 4.19,58.15 4.18,58.17 | v27.7,78.48 23.88,82.3 v23.88,82.8 | C7.1 40.41,78.23 v42.44,76.2 | R14.1 47.5,77.72 v45.97,76.2 44.7,77.47 R15.1 | C16.1 75.31,90.11 U5.8 | U5.8 77.85,91.31 79.25,92.71 v80.01,92.71 80.39,93.09 U5.3 80.39,96.33 79.76,96.96 R20.1 | U5.7 U5.8 | v77.47,76.71 78.6,75.58 MICROSD.4 81.17,75.58 v81.79,76.2 | v79.25,82.04 78.81,82.48 C14.1 R19.1 | MS1.2B v79.12,42.16 77.23,42.16 76.98,41.91 | v62.23,100.84 62.23,100.2 56.77,94.74 v48.51,94.74 | C19.2 20.22,87.8 20.22,87.91 19.7,88.42 v19.56,88.42 | v16.76,83.97 16.76,84.23 14.61,86.39 v14.61,86.49 | v12.45,88.65 11.95,89.14 11.95,93.24 11.54,93.65 7.12,93.65 6.1,94.67 L1.P$1 2.87,94.67 1.52,96.01 1.52,103.89 2.92,105.28 2.92,107.57 4.32,108.97 14.22,108.97 JP2.1
+3V3  (via drill 0.3, 0.51)
  Top 0.305: v74.17,108.71 v66.61,108.71
  Top 0.508: v41.66,102.87 44.6,105.82 v51.05,105.82 | v43.94,28.45 v43.94,39.62 43.94,50.93 41.66,53.21 v41.66,70.28 | v41.66,93.47 v41.66,86.94 41.66,75.18 v44.49,72.35 v44.49,72.34 | v35.31,24.57 v27.94,24.57
  Bottom 0.305: R10.2 74.49,109.03 v74.17,108.71
  Bottom 0.508: U1.6 37.02,86.14 37.37,85.79 C4.1 C5.1 v41.66,86.94 | v51.05,105.82 v51.06,105.81 U3.2 65.19,105.81 C11.1 C10.1 v66.61,108.71 C9.1 | v43.94,28.45 40.07,24.57 v35.31,24.57 | v27.94,24.57 R9.2 | v41.66,102.87 v41.66,93.47 | v44.49,72.34 v44.48,72.34 42.42,70.28 v41.66,70.28 | MS1.3B MS1.3 v43.94,39.62
A0  (via drill 0.3)
  Top 0.305: v76.33,63.37 76.33,37.34 v79.12,34.54
  Bottom 0.305: MS1.5B v79.12,34.54 MS1.5 | U3.20 57.37,83.35 76.33,64.39 v76.33,63.37
A1  (via drill 0.3)
  Top 0.305: v75.31,63.37 75.31,35.81 v79.12,32
  Bottom 0.305: MS1.6 v79.12,32 MS1.6B | U3.21 55.87,83.32 75.31,63.88 v75.31,63.37
A2  (via drill 0.3)
  Top 0.305: v66.53,102.09 66.53,102.04 74.37,94.19 74.37,29.94 v74.84,29.46
  Bottom 0.305: v74.84,29.46 MS1.7 MS1.7B | U3.4 65.04,102.81 65.77,102.09 v66.53,102.09
A3  (via drill 0.3)
  Top 0.305: v65.53,101.31 73.41,93.44 73.41,28.36 v74.84,26.92
  Bottom 0.305: U3.5 v65.53,101.31 | v74.84,26.92 MS1.8 MS1.8B
A4  (via drill 0.3)
  Top 0.305: v65.53,99.81 72.44,92.91 72.44,26.79 v74.84,24.38
  Bottom 0.305: U3.6 v65.53,99.81 | v74.84,24.38 MS1.9 MS1.9B
A5  (via drill 0.3)
  Top 0.305: v65.53,98.31 71.48,92.37 71.48,25.21 v74.84,21.84
  Bottom 0.305: U3.7 v65.53,98.31 | v74.84,21.84 MS1.10 MS1.10B
A6
  Bottom 0.305: PORT_A6.3 10.13,68.1 12.13,66.11 R18.1
A7
  Bottom 0.305: PORT_A7.3 7.3,42.16 10.16,42.16 16.26,48.26 R17.1
A8_BUSMON
  Bottom 0.279: 52.12,85.64 R16.1
  Bottom 0.305: U3.18 60.37,84.19 57.96,86.61 53.09,86.61 52.12,85.64 | R16.2 R16.1
A9_BATMON
  Bottom 0.279: 55.12,84.94 55.12,82.42
  Bottom 0.305: U3.19 58.87,84.64 57.91,85.6 55.77,85.6 55.12,84.94 | R16.3 R16.4 54.56,81.86 55.12,82.42
BABEL_CS
  Bottom 0.254: 62.99,91.56 64.77,91.56
  Bottom 0.305: U3.32 47.13,92.31 47.88,91.56 62.99,91.56 | 64.77,91.56 68.26,91.56 71.76,95.06 R20.2 77.6,95.06 U5.1
BOOT0/LOCK
  Bottom 0.305: U3.3 64.62,104.31 65.89,103.05 69.85,103.05 76.39,109.59 R10.1 77.68,111.27 BTN_LOCK.P$2
BTN_DOWN  (via drill 0.3)
  Top 0.305: BTN_DOWN.P$1 39.8,4.3 39.8,50.04 31.93,57.91 v31.24,57.91
  Bottom 0.305: U4.11 31.18,57.98 v31.24,57.91
BTN_LEFT  (via drill 0.3)
  Top 0.305: BTN_LEFT.P$1 35.3,14.73 37.87,17.3 37.87,49.66 32.44,55.1 v32.44,55.42
  Bottom 0.305: U4.10 32.45,55.43 v32.44,55.42
BTN_NEXT  (via drill 0.3)
  Top 0.305: v28.07,62.23 31.07,62.23 42.7,50.6 42.7,22.69 56.39,9 BTN_NEXT.P$1
  Bottom 0.305: U4.16 24.82,63.82 26.42,62.23 v28.07,62.23
BTN_PREV  (via drill 0.3)
  Top 0.305: BTN_PREV.P$1 28.42,9 36.89,17.47 36.89,49.38 26.16,60.11 v26.16,63.5
  Bottom 0.305: U4.15 26.09,63.57 v26.16,63.5
BTN_RIGHT  (via drill 0.3)
  Top 0.305: v28.96,61.21 30.94,61.21 41.73,50.42 41.73,22.5 49.7,14.53 BTN_RIGHT.P$1
  Bottom 0.305: v28.96,61.21 28.96,62.64 28.64,62.96 U4.13
BTN_SEL  (via drill 0.3)
  Top 0.305: BTN_CENTER.P$1 40.77,14.73 40.77,50.23 30.37,60.63 28.71,60.63 27.43,61.91 v27.43,63.25
  Bottom 0.305: U4.14 27.36,63.31 v27.43,63.25
BTN_UP  (via drill 0.3)
  Top 0.305: BTN_UP.P$1 38.84,15.34 38.84,49.85 31.92,56.77 31.05,56.77 29.97,57.85 v29.97,57.91
  Bottom 0.305: U4.12 29.91,57.98 v29.97,57.91
CC1
  Bottom 0.203: USB.A5 37.48,108.22 36.19,109.52 35.51,109.52 34.98,108.99 34.98,104.9 34.54,104.47 R2.1
CC2
  Bottom 0.203: R1.1 42.49,105.02 42.49,108.99 41.96,109.52 41.29,109.52 40.48,108.71 USB.B5
D5  (via drill 0.3)
  Top 0.305: v65.53,96.81 70.51,91.84 70.51,21.63 v60.57,11.68
  Bottom 0.305: U3.8 v65.53,96.81 | v60.57,11.68 MS1.19 MS1.19B
D6  (via drill 0.3)
  Top 0.305: v65.53,95.31 69.55,91.3 69.55,23.2 v60.57,14.22
  Bottom 0.305: U3.9 v65.53,95.31 | v60.57,14.22 MS1.20 MS1.20B
D7_A6  (via drill 0.3)
  Top 0.305: v14.73,72.14 30.23,87.63 37.34,87.63 38.48,88.77 38.48,89.28 v39.37,90.17
  Bottom 0.254: 45.47,94.54 47.28,94.54
  Bottom 0.305: R18.2 D3.C 14.68,72.14 v14.73,72.14 | U3.10 48.01,93.81 47.28,94.53 47.28,94.54 | v39.37,90.17 43.74,94.54 45.47,94.54
D8_A7  (via drill 0.3)
  Top 0.305: v39.62,88.67 39.62,88.63 37.78,86.79 32.69,86.79 v18.03,72.14
  Bottom 0.254: 45.47,93.04 47.28,93.04
  Bottom 0.305: R17.2 D2.C 16.31,70.41 v18.03,72.14 | U3.11 48.01,92.31 47.28,93.03 47.28,93.04 | v39.62,88.67 44,93.04 45.47,93.04
D9  (via drill 0.3)
  Top 0.305: v65.53,90.81 68.58,87.77 68.58,24.77 v60.57,16.76
  Bottom 0.305: U3.12 v65.53,90.81 | v60.57,16.76 MS1.21 MS1.21B
D10  (via drill 0.3)
  Top 0.305: v65.53,89.31 67.61,87.23 67.61,26.35 v60.57,19.3
  Bottom 0.305: U3.13 v65.53,89.31 | v60.57,19.3 MS1.22 MS1.22B
D11  (via drill 0.3)
  Top 0.305: v65.53,87.81 66.65,86.7 66.65,27.93 v60.57,21.84
  Bottom 0.305: U3.14 v65.53,87.81 | v60.57,21.84 MS1.23 MS1.23B
D12  (via drill 0.3)
  Top 0.305: v65.53,86.31 65.68,86.16 65.68,29.5 v60.57,24.38
  Bottom 0.305: U3.15 v65.53,86.31 | v60.57,24.38 MS1.24 MS1.24B
D13  (via drill 0.3)
  Top 0.305: v60.57,26.92 64.72,31.07 64.72,83.59 v64.52,83.8 64.59,83.87 64.59,101.8 68.45,105.66 v68.71,105.66
  Bottom 0.305: U3.16 63.87,84.46 v64.52,83.81 v64.52,83.8 | v60.57,26.92 MS1.25 MS1.25B | v68.71,105.66 70.81,107.76 R11.1
D14_SDCS  (via drill 0.3)
  Top 0.305: v81.76,73.38 81.76,48.19 83.21,46.74 83.21,10.69 v79.12,6.6
  Bottom 0.305: U3.17 72.55,73.38 MICROSD.2 v81.76,73.38 84.33,75.95 84.33,82.98 R19.2 | MS1.16B v79.12,6.6 MS1.16
EINK_BUSY  (via drill 0.25)
  Top 0.254: v19.56,87.63 20.71,87.63 30.22,97.14 43.94,97.14 v45.11,98.31
  Bottom 0.254: U$2.9 19.04,87.23 19.44,87.63 v19.56,87.63 | U3.36 v45.11,98.31
EINK_CS  (via drill 0.25)
  Top 0.254: v19.56,85.65 21.98,85.65 30.98,94.66 43.3,94.66 v43.98,93.98
  Bottom 0.254: U$2.12 19.45,85.73 19.54,85.65 v19.56,85.65 | U3.33 44.15,93.81 v43.98,93.98
EINK_DC  (via drill 0.25)
  Top 0.254: v19.56,86.31 21.55,86.31 30.74,95.5 44.7,95.5 v44.96,95.25
  Bottom 0.254: U$2.11 19.45,86.23 19.54,86.31 v19.56,86.31 | U3.34 46.3,95.25 v44.96,95.25
EINK_RST  (via drill 0.25)
  Top 0.254: v19.56,86.97 21.13,86.97 30.51,96.36 44.57,96.36 v44.98,96.77
  Bottom 0.254: U$2.10 19.22,86.73 19.46,86.97 v19.56,86.97 | U3.35 46.33,96.77 v44.98,96.77
EN  (via drill 0.3)
  Top 0.305: v8.38,11.94 v30.99,34.54 30.99,49.53 24.64,55.88 24.64,76.9 30.51,82.77 v30.51,83.79
  Bottom 0.305: MS1.27 MS1.27B 52.34,32 49.8,34.54 v30.99,34.54 | v8.38,11.94 6.86,10.41 SW1.2 | U1.4 33.34,86.14 32.99,85.79 R3.1 30.51,84.55 v30.51,83.79
EN2  (via drill 0.3)
  Top 0.305: v32,80.52 32,79.95 33.02,78.93 37.6,78.93 v39.7,81.03
  Bottom 0.305: R4.2 30.04,82.8 | U1.3 33.59,83.54 32.86,82.8 30.04,82.8 | 30.04,82.8 32,80.84 v32,80.52 | v39.7,81.03 42.58,81.03 43.83,79.78 48.79,79.78 51.37,82.36 U3.24
GDR  (via drill 0.25)
  Top 0.254: v14.48,91.44 v11.43,94.49
  Bottom 0.254: Q2.1 9.16,94.81 11.11,94.81 v11.43,94.49 | U$2.2 15.19,90.73 v14.48,91.44
GND  (via drill 0.51)
  Bottom 0.508: C10.2 C9.2 67.64,111.36 67.64,111.41 67.53,111.52 | U3.1 65.53,108.98 65.53,111.35 65.83,111.65 67.4,111.65 67.53,111.52 | 67.53,111.52 LED.C | C11.2 69.88,104.39 73.23,107.75 73.23,111.06 73.48,111.32 BTN_LOCK.P$1
  other vias: 16.51,83.06 17.53,97.66 7.87,100.58 60.71,107.44 51.31,107.44 48.51,65.02 44.45,66.8 25.91,72.14 24.38,80.26 24.38,84.58 30.48,80.52 32.77,77.6 32.77,81.66 37.34,80.14 14.48,51.31 83.44,79.25 78.74,77.98 38.73,109.73 16.51,88.14 44.45,83.06 53.34,82.55 75.95,78.23 76.45,89.15 75.95,80.77 76.45,93.73 76.83,90.93 42.93,79.25 43.43,89.66 55.12,87.82
  pour Bottom: 93.61,108.46 85.6,108.46 85.09,108.97 70.61,108.97 70.1,108.46 44.2,108.46 44.2,111.25 41.8,111.25 38.24,114.81 0.76,114.81 -2.29,111.76 -2.29,1.27 0.76,-1.78 88.79,-1.78 93.61,3.05
  pour Top: 95.39,108.97 74.68,108.97 74.17,108.46 44.45,108.46 38.1,114.81 -1.52,114.81 -4.06,112.27 -4.06,-3.03 88.81,-3.03 95.39,3.56
MISO  (via drill 0.3)
  Top 0.305: v78.74,79.5 80.47,77.78 80.47,48.33 82.25,46.56 82.25,31.48 80.21,29.45 80.21,15.32 v79.12,14.22
  Bottom 0.254: 62.99,90.06 64.77,90.06
  Bottom 0.305: U3.31 47.13,90.81 47.88,90.06 62.99,90.06 | 64.77,90.06 68.18,90.06 68.2,90.04 | MICROSD.7 79.36,78.88 v78.74,79.5 68.2,90.04 | U5.2 79.12,94.24 76.32,91.44 69.6,91.44 68.2,90.04 | MS1.13 v79.12,14.22 MS1.13B
MOSI  (via drill 0.25, 0.3)
  Top 0.305: v78.56,74.48 78.49,74.41 78.49,48.01 80.31,46.18 80.31,31.86 78.03,29.58 78.03,17.79 79.06,16.76 v79.12,16.76 | v37.05,88.68 27.28,88.68 22.91,84.31 19.31,84.31 v19.21,84.4
  Bottom 0.254: 62.99,87.06 64.77,87.06 | U$2.14 18.88,84.73 v19.21,84.4
  Bottom 0.305: 64.77,87.06 65.97,87.06 v78.56,74.48 MICROSD.3 81.59,74.48 82.55,75.44 82.55,78.88 81.49,79.94 81.49,81.15 79.76,82.89 79.76,87.53 81.66,89.43 U5.5 | 62.99,87.06 47.88,87.06 47.13,87.81 U3.29 46.18,87.63 38.1,87.63 v37.05,88.68 | MS1.12 v79.12,16.76 MS1.12B
N$1
  Bottom 0.305: RATE1.1 38.35,65.53 R7.1
N$2
  Bottom 0.305: C26.2 4.96,106.5 D6.C 7.87,106.35 11.18,103.05 D5.A
N$3
  Bottom 0.305: D4.A 13.28,101.6 10.41,101.6 9.64,102.37 9.64,103.37 8.8,104.21 C26.1 4.32,103.95 L1.P$2 4.57,98.27 6.96,95.89 10.88,95.89 Q2.3
N$4
  Bottom 0.305: R13.1 28.42,109.61 27.54,110.49 27.54,113.11 CHG.C
N$5
  Bottom 0.305: RATE2.1 35.56,65.79 R8.1
N$7
  Bottom 0.305: LED.A 71.3,112.25 R11.2
N$9
  Bottom 0.305: FUL.A 30.73,108.65 R12.1
PREVGH
  Bottom 0.254: C25.1 13.61,95.34 13.61,83.85 16.23,81.23 U$2.21
  Bottom 0.305: D4.C 15.49,105.48 15.49,97.22 C25.1
PREVGL
  Bottom 0.254: U$2.23 16.54,80.23 13.21,83.57 13.21,97.72 C24.1
  Bottom 0.305: D6.A 7.87,102.54 10.09,100.33 13.27,100.33 C24.1
PROG
  Bottom 0.305: 41.18,68.33 41.37,68.51 U2.5 | R6.1 41.18,64.49 41.18,68.33 | RATE2.2 RATE1.2 40.93,68.58 41.18,68.33
RESE  (via drill 0.25)
  Top 0.254: v16.26,90.2 16.26,92.71 v11.94,97.03
  Bottom 0.254: Q2.2 9.16,97.22 11.75,97.22 v11.94,97.03 | U$2.3 16.29,90.23 v16.26,90.2
  Bottom 0.305: R21.1 8.91,97.83 Q2.2
RESET  (via drill 0.3)
  Top 0.305: v7.87,23.37 v29.21,44.7 20.83,53.09 20.83,64.77 13.72,71.88 13.72,84.11 27.57,97.96 42.81,97.96 44.15,99.29 44.15,103.94 44.98,104.78 45.04,104.78 v45.19,104.92
  Bottom 0.305: R9.1 5.33,22.67 4.57,23.44 BTN_RESET.P$2 | R9.1 C12.1 | R9.1 7.18,22.67 v7.87,23.37 | v29.21,44.7 MS1.1 MS1.1B | U3.41 46.08,105.81 v45.19,104.92
RX  (via drill 0.3)
  Top 0.305: JP1.3 8.26,109.35 28.26,109.35 29.48,110.57 41.07,110.57 44.32,107.31 v48.26,107.31 49.07,106.5 52.71,106.5 62.84,96.37 v62.84,35.81
  Bottom 0.305: MS1.14B MS1.14 75.18,11.68 63.75,23.11 63.75,34.54 62.84,35.46 v62.84,35.81 | U3.38 46.7,101.31 48.26,102.87 v48.26,107.31
SCK  (via drill 0.25, 0.3)
  Top 0.305: v78.64,76.68 79.5,75.82 79.5,48.15 81.28,46.37 81.28,31.67 79.12,29.52 v79.12,19.3 | v19.56,84.99 19.58,84.97 22.41,84.97 27.32,89.88 v37.62,89.88
  Bottom 0.254: 62.99,88.56 64.77,88.56 | U$2.13 19.22,85.23 19.46,84.99 v19.56,84.99
  Bottom 0.305: 64.77,88.56 66.76,88.56 v78.64,76.68 MICROSD.5 81,76.68 81.53,77.22 81.53,78.23 81.04,78.73 81.04,80.46 80.25,81.24 79,81.24 77.8,82.44 77.8,87.49 78.25,87.94 78.78,87.94 80.39,89.55 U5.6 | 62.99,88.56 47.88,88.56 47.13,89.31 U3.30 45.86,89.31 44.63,88.09 39.36,88.09 37.62,89.82 v37.62,89.88 | MS1.11 v79.12,19.3 MS1.11B
SCL  (via drill 0.3)
  Top 0.305: v21.59,42.93 v10.41,54.1 9.83,54.69 9.83,56.82 v17.02,64.01 | v39.7,82.8 36.07,82.8 33.27,80.01 v33.26,80.02
  Bottom 0.305: R14.2 47.5,85.6 46.78,86.31 U3.28 45.98,86.31 42.47,82.8 v39.7,82.8 | MS1.18 MS1.18B 47.73,9.14 22.86,34.02 22.86,41.66 v21.59,42.93 | PORT_I2C.4 10.37,54.15 v10.41,54.1 | v17.02,64.01 17.82,64.81 17.82,68.01 22.23,72.42 U4.1 22.23,75.06 24.89,77.72 30.97,77.72 v33.26,80.02
SDA  (via drill 0.3)
  Top 0.305: v21.84,41.15 21.91,41.15 22.68,41.92 22.68,44.37 v10.92,56.13 18.29,63.5 v18.29,64.01 | v35.32,80.1 37.13,81.92 v39.7,81.92
  Bottom 0.305: U3.27 46.37,82.37 R15.2 43.49,81.92 v39.7,81.92 | MS1.17 MS1.17B 49.02,6.6 21.84,33.78 v21.84,41.15 | PORT_I2C.3 7.27,56.13 v10.92,56.13 | v18.29,64.01 18.67,64.39 18.67,67.65 23.5,72.47 U4.2 23.5,75.52 25.12,77.14 31.23,77.14 31.57,77.48 31.57,77.5 34.17,80.1 v35.32,80.1
SDCD  (via drill 0.3)
  Top 0.305: v61.85,80.26 53.98,80.26 v43.31,69.6
  Bottom 0.305: MICROSD.CD2 62.8,80.26 v61.85,80.26 | v43.31,69.6 27.18,69.6 23.52,65.94 U4.17
STAT  (via drill 0.3)
  Top 0.305: v46.99,68.58 43.5,68.58 42.34,69.73 42.34,70.57 36.02,76.89 31.83,76.89 v30.23,78.49
  Bottom 0.305: R12.2 R13.2 28.42,87.05 27.9,86.53 27.9,80.81 v30.23,78.49 | v46.99,68.58 46.92,68.51 U2.1
TX  (via drill 0.3)
  Top 0.305: JP1.1 12.5,110.19 27.89,110.19 29.11,111.4 41.39,111.4 44.3,108.49 v48.29,108.49 52.8,108.49 63.78,97.51 63.78,34.91 62.91,34.04 v62.87,34.04
  Bottom 0.305: MS1.15B MS1.15 75.2,9.14 62.87,21.48 v62.87,34.04 | U3.37 46.5,99.81 48.84,102.16 48.84,107.94 v48.29,108.49
USB_N  (via drill 0.25, 0.3)
  Top 0.254: v39.09,104.27 39.09,103.83 43.36,99.57 v43.43,99.57 | v53.59,95.76 v53.59,85.85
  Bottom 0.254: USB.B7 37.98,105.37 v39.09,104.27 39.22,104.39 39.22,105.91 38.98,106.14 USB.A7 | v43.43,99.57 44.58,98.42 44.58,98.09 45.13,97.54 45.49,97.54 45.5,97.54 47.5,97.54 48.59,96.45 52.9,96.45 v53.59,95.76
  Bottom 0.305: U3.22 54.37,85.08 v53.59,85.85
USB_P  (via drill 0.25, 0.3)
  Top 0.254: v43.07,99 41.99,99 38.12,102.87 38.12,105.16 | v52.58,95.76 53.09,95.25 53.09,86.14 53.03,86.08 53.03,85.62 53.09,85.56 v53.09,85.35
  Top 0.305: 38.12,105.16 v38.63,105.66
  Bottom 0.254: USB.B6 39.48,108.34 39.12,108.71 38.86,108.71 38.48,108.33 38.48,107.7 | USB.A6 38.48,105.81 v38.63,105.66 | v43.07,99 44.45,97.62 44.45,96.52 44.93,96.04 52.29,96.04 v52.58,95.76
  Bottom 0.305: U3.23 52.87,85.13 v53.09,85.35 | 38.48,107.7 USB.A6
V+
  Bottom 0.305: R3.2 32.89,83.89 33.7,84.69 34.4,84.69 35.05,85.34
  Bottom 0.508: D1.C 39.88,93.11 36,89.23 C3.1 36,88.58 35.05,87.63 U1.5 35.05,85.34 35.81,84.58 36.58,84.58 37.59,83.57 37.59,81.28 39.03,79.84 40.73,79.84 Q1.2
VBAT  (via drill 0.51)
  Top 0.508: v56.26,34.54 v56.26,46.74
  Bottom 0.305: BATTERY.2 53.75,69.11 R16.6
  Bottom 0.508: BATTERY.2 48.56,68.56 C8.1 48.45,68.51 | 48.45,68.51 46.55,66.61 U2.3 45.75,57.25 v56.26,46.74 | 48.45,68.51 48.51,68.58 46.48,70.61 Q1.3 | MS1.28 v56.26,34.54 MS1.28B
VBUS  (via drill 0.3, 0.51)
  Top 0.305: v29.72,109.98 34.68,105.02 v37.2,105.02
  Top 0.508: v38.1,92.46 40.39,90.17 v40.39,75.69 | v54.1,46.74 54.1,31.62 v56.26,29.46
  Bottom 0.305: v29.72,109.98 29.72,110.65 CHG.A | Q1.1 46.53,72.14 47.75,72.14 52.12,76.5 R16.8
  Bottom 0.508: USB.A4/B9 36.34,105.88 v37.2,105.02 40.07,102.15 C1.1 | USB.B4/A9 41.13,106.16 40.07,105.09 C1.1 | C1.1 C2.1 40.07,97.29 D1.A 38.1,95.32 v38.1,92.46 | v40.39,75.69 41.47,74.61 R5.1 44.07,74.61 Q1.1 45.53,70.6 44.45,69.51 44.45,68.33 43.15,67.03 U2.4 43.15,57.69 v54.1,46.74 | MS1.26B v56.26,29.46 MS1.26
VCOM
  Bottom 0.254: U$2.24 18.12,79.73 C23.2
VDD
  Bottom 0.254: U$2.18 19.23,82.73 20.64,84.14 C20.2
VGH
  Bottom 0.254: U$2.5 18.88,89.23 19.56,89.92 C18.2
VGL
  Bottom 0.254: U$2.4 18.61,89.73 19.3,90.42 19.3,90.93 20.64,92.27 C17.2
VSH
  Bottom 0.254: U$2.20 20.08,81.73 C21.2
VSL
  Bottom 0.254: U$2.22 19.66,80.73 C22.2

### Text on the board
tPlace: RX | GND | TX | 3V | Project info: | https://github.com/joeycastillo/The-Open-Book/ | @josecastillo | ``Auntie, there's one thing I can't figure out." / / ``Only one?" She smiled and he smiled back. / / ``For now. When I bring a notepad to school, I can write / anything I want on it. I don't need to ask the company that / made the pen or the store that sold me the notebook how / I can use it. I can tear out the pages and make paper / airplanes, or doodle, or copy down what the teacher says. / When I put on a pair of shoes, I can wear any socks I want. / I can walk anywhere I want to go on my shoes. I can wipe / myself with any sort of toilet paper—" That got a laugh. / ``But I can't toast any bread I want in my toaster." / / She waited. He was struggling to find the words. ``What's / the question, Abdirahim?" / / He shook his head, shrugged. ``I guess I don't know. I just / want to understand, how can it be against the law to choose / your bread but not your socks? What makes a toaster / different from shoes?" / / She opened her mouth to answer, but discovered she didn't / know the answer. Right up until that moment she'd felt like / she had some intuitive sense of which things were objects- / with-rules and which ones were objects-without-rules, felt / it so readily that she hadn't even named the two categories / until just that instant. Now that she tried to come up with a / rule to explain the difference between the two, she found / she couldn't. / / ``That is an excellent question," she said at last. ``Why don't / you research the answer and tell us all what you find out." / / - From ``Unauthorized Bread" by Cory Doctorow | THE OPEN BOOK | OSO | OSO-BOOK-B1-00
bPlace: SERIAL / PORT | RX | GND | TX | 3V | This is / ESP32-S2's UART0. IO43=TX; IO44=RX | LOCK_BTN | Also BOOT0/IO0. / Hold at reset / for bootloader / mode. | 4.2 INCH / E-PAPER / DISPLAY | USB-C / PORT | LED | CHARGE / STATUS | BABEL / FLASH CHIP | IO39=ECS / IO40=EDC / IO41=ERST / IO42=EBUSY / Powered by / secondary / regulator. | Green: full. / Amber: / charging. / Off: using / battery. | A simple / red light / for status / &blinking. / Pin IO13. | On main SPI bus. | 2MB of fonts for / most languages / of the world. | ESP32 / -S2 / WROVER / MODULE | On main SPI. / BCS is IO38. | WiFI MCU with 4MB / Flash and 2MB / SRAM. See below / for more detail. | U1. One 300 mA / output is just for / the ESP32-S2. The / other powers all / the other stuff on / the board, / including the / FeatherWing. / Control this / output using / EN2/IO21. | See below for more. | D1, Q1 & R5 conspire to let / only the higher of / VBAT and VBUS reach / dual 3.3v / regulator | POWER / SUPPLY | I²C / BUS / PULL-UPS | POWER MONITORS | USB=A8=IO15. / BATTERY=A9=IO16. / See notes below. | Max 300mA / per output. | \!\! DANGER \!\! | BATTERY AND CHARGING | See below for more detail. | GND | SEE NOTES / BEFORE / ADJUSTING / CHARGE RATE!! | By default / a 100 mA / rate of / charge is / set. Each / jumper ups / this rate / by 100 mA. MAKE SURE YOUR BATTERY / SUPPORTS THE DESIRED CHARGE RATE!!! | 3V | See below / for more. | + | VBAT | A6 | - | GND | MICROSD SLOT | Current limit / resistors & / protection / diodes | GPIO EXPANDER | On main SPI, secondary / power. SDCS=IO14. Card / detect on IO expander. | I²C address is 0x20 | GND | SUPPLEMENTAL INFORMATION AND / SAFE AREA FOR BATTERY MOUNTING | THIS OPEN BOOK BELONGS TO | 3V | SDA | POWER SUPPLY: For low power use, the board has 2 / 3.3 volt power domains. The primary output is / enabled when SW1 is on; it powers the ESP32-S2. / The secondary output powers all other devices on / board; off by default, set EN2/IO21 high to enable. | SCL | FEATHER HEADERS | BATTERY: By default the battery charges at 100mA. / IF YOUR BATTERY SUPPORTS A FASTER RATE, you may / close one solder jumper to charge at 200mA or both / to charge at 300mA. Be absolutely sure your battery / supports the desired rate! Charging too fast can / damage the battery and cause overheating or fire. | For expanding the capabilities / of your Open Book! 3V pin is / from secondary regulator; / AREF is tied to primary / regulator output. | GND | RESET | 3V | A7 | 3V | ESP32-S2 WROVER MODULE: This module includes a / WiFi-enabled microcontroller, 2MB of SRAM, 4MB of / Flash (the CIRCUITPY drive, when using the board / with CircuitPython) and a PCB antenna. Most pins / fan out to the Feather headers and STEMMA ports, / and can be used for almost any purpose. The DAC / pins are fixed as A0/IO17 and A1/IO18. | AREF / (3V) | GND | Center port is I²C. Other two ports: / A7 on bottom is IO8, A6 up top is IO7. | JST PORTS (STEMMA) | The Open Book by Joey / Castillo @josecastillo. / Inspired largely by / @Adafruit's awesome / open source designs! / Crafted with in BK, NY. | VBAT | A0 / IO17 | RESET BUTTON/LOCK BTN: The ESP32-S2 has a built- / in bootloader. Activate it by holding down the / lock button and then pressing reset. The lock / button is also IO0 on the ESP32-S2; when it's not / doing boot duty, you can use it as a button input. | EN | A1 / IO18 | VBUS | A2 / IO1 | RESET BUTTON | LED / IO13 | A3 / IO2 | R9 pulls / ESP32-S2's / enable pin / high. The / button / pulls it / low when / pressed. | POWER MONITORS: A pair of voltage dividers on VBAT / and VBUS. To read the battery or USB voltage, / measure the analog value and multiply by two. | IO12 | A4 / IO3 | IO11 | A5 / IO4 | STEMMA PORTS: A6 and A7 pins are available as / STEMMA-compatible ports; you can map them to any / function except the DAC (i.e. analog in, PWM, etc). / A current limiting resistor lets you run an LED / right off the output, and 3.6V zener diodes provide / protection from higher voltage inputs. The I²C port / in the center is shared with the on-board GPIO / expander and Feather SDA/SCL pins. 3V power to the / ports comes from the secondary regulator output. | IO10 | SCK / IO36 | IO9 | MOSI / IO35 | ENABLE / SWITCH | ON | IO6 | MISO / IO37 | IO5 | RX / IO44 | R1 up top / pulls EN / high. SW1 / pulls EN / low, which / disables regu- / lator U1 (and / with it, most / of the board). | THE OPEN | GPIO EXPANDER: On the I²C bus, uses secondary pwr. / It handles the buttons on the front and the SD card / detect signal. Enable pull-ups; signals are active / low. Pins: 0=Left, 1=Down, 2=Up, 3=Right, 4=Center, / 5=Previous Page, 6=Next Page, 7=SD Card Detect. | SCL / IO34 | BOOK | TX / IO43 | OFF | SDA / IO33 | SDCS / IO14 | BABEL FLASH CHIP: Also on secondary power. Flash / babel.bin on here for Unicode/Unifont glyph data. | THE OPEN BOOK IS / OPEN SOURCE HARDWARE! / CC-BY-SA 4.0 | plz don't steal the bear tho.
tStop: THE OPEN BOOK
bDocu: 306070 1800 mAh battery / https://www.aliexpress.com/item/32927730430.html | 505060 2000mAh battery / https://www.aliexpress.com/item/32909666222.html | For use with no feather headers installed: | 785060 2500 mAh battery / https://adafru.it/2011 / / WARNING: Thick at ~7.2mm | 494251 1500 mAh battery / https://www.aliexpress.com/item/33046960888.html | For use with feather headers installed: | 803860 2000 mAh battery / https://adafru.it/2011 / / WARNING: Thick at ~7.5mm